# EAGLE design TheRug-Andabil-R2 (EAGLE 7.7.0)

## Sheet 1 of 2
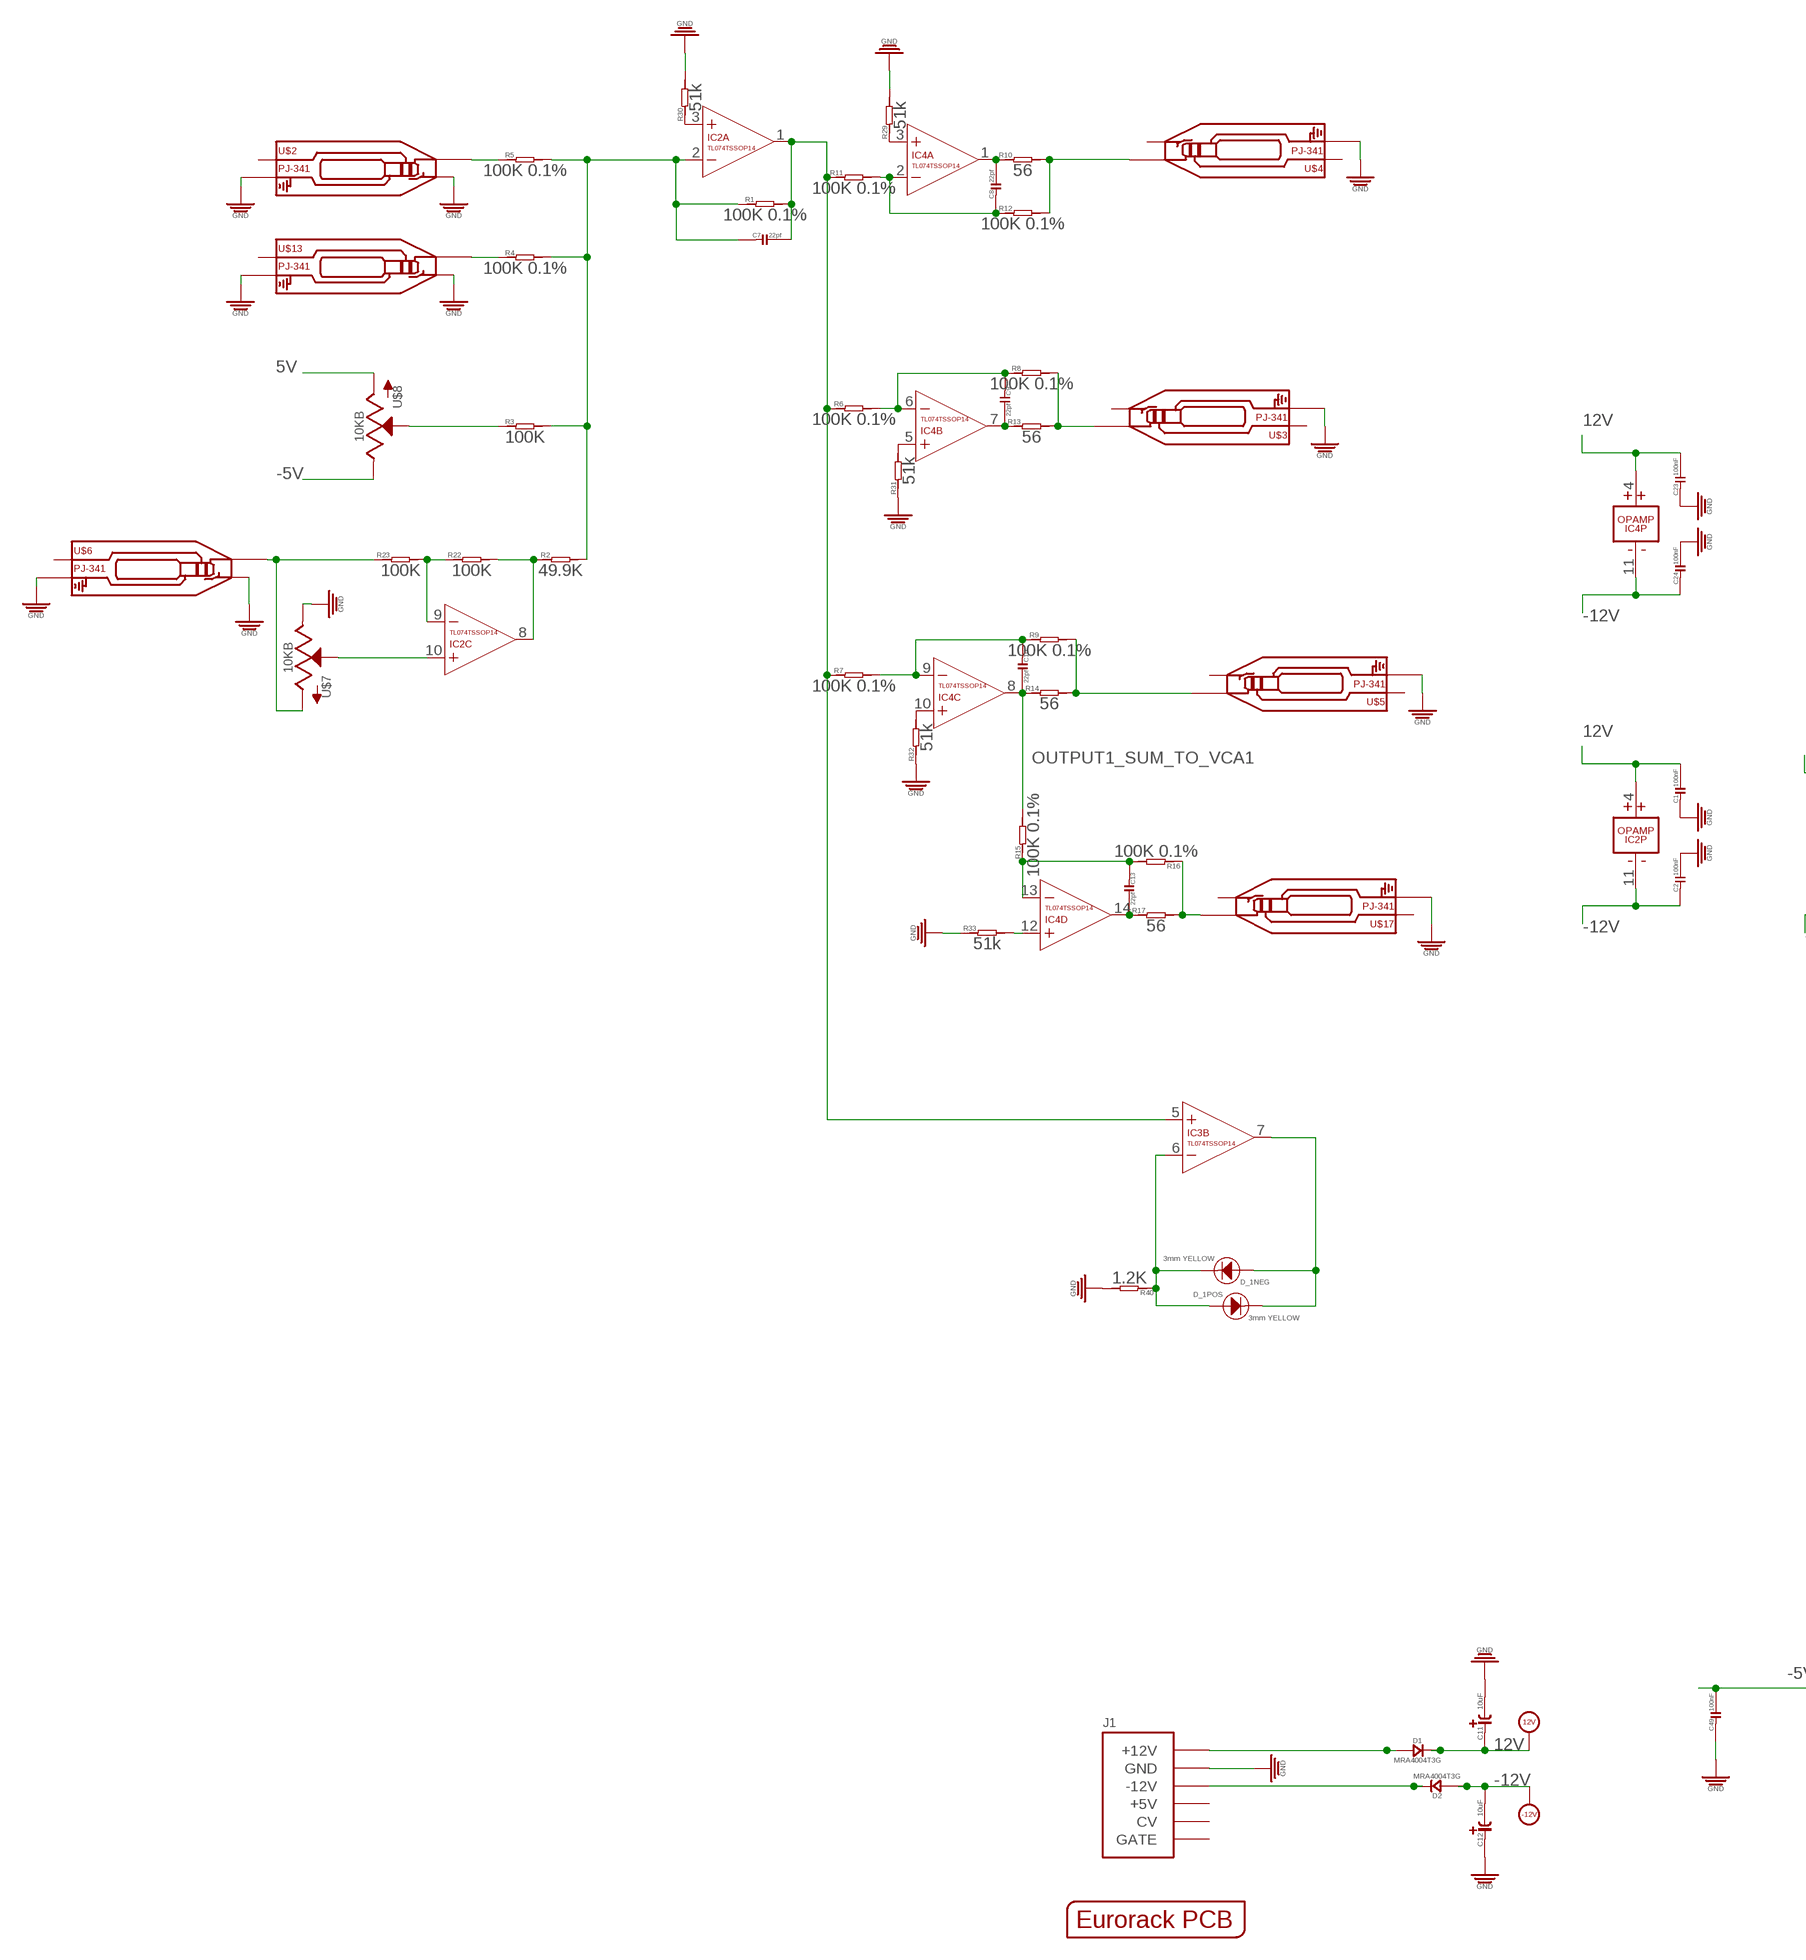
[diagram p0: schematic, sheet 1, part 1 of 2]
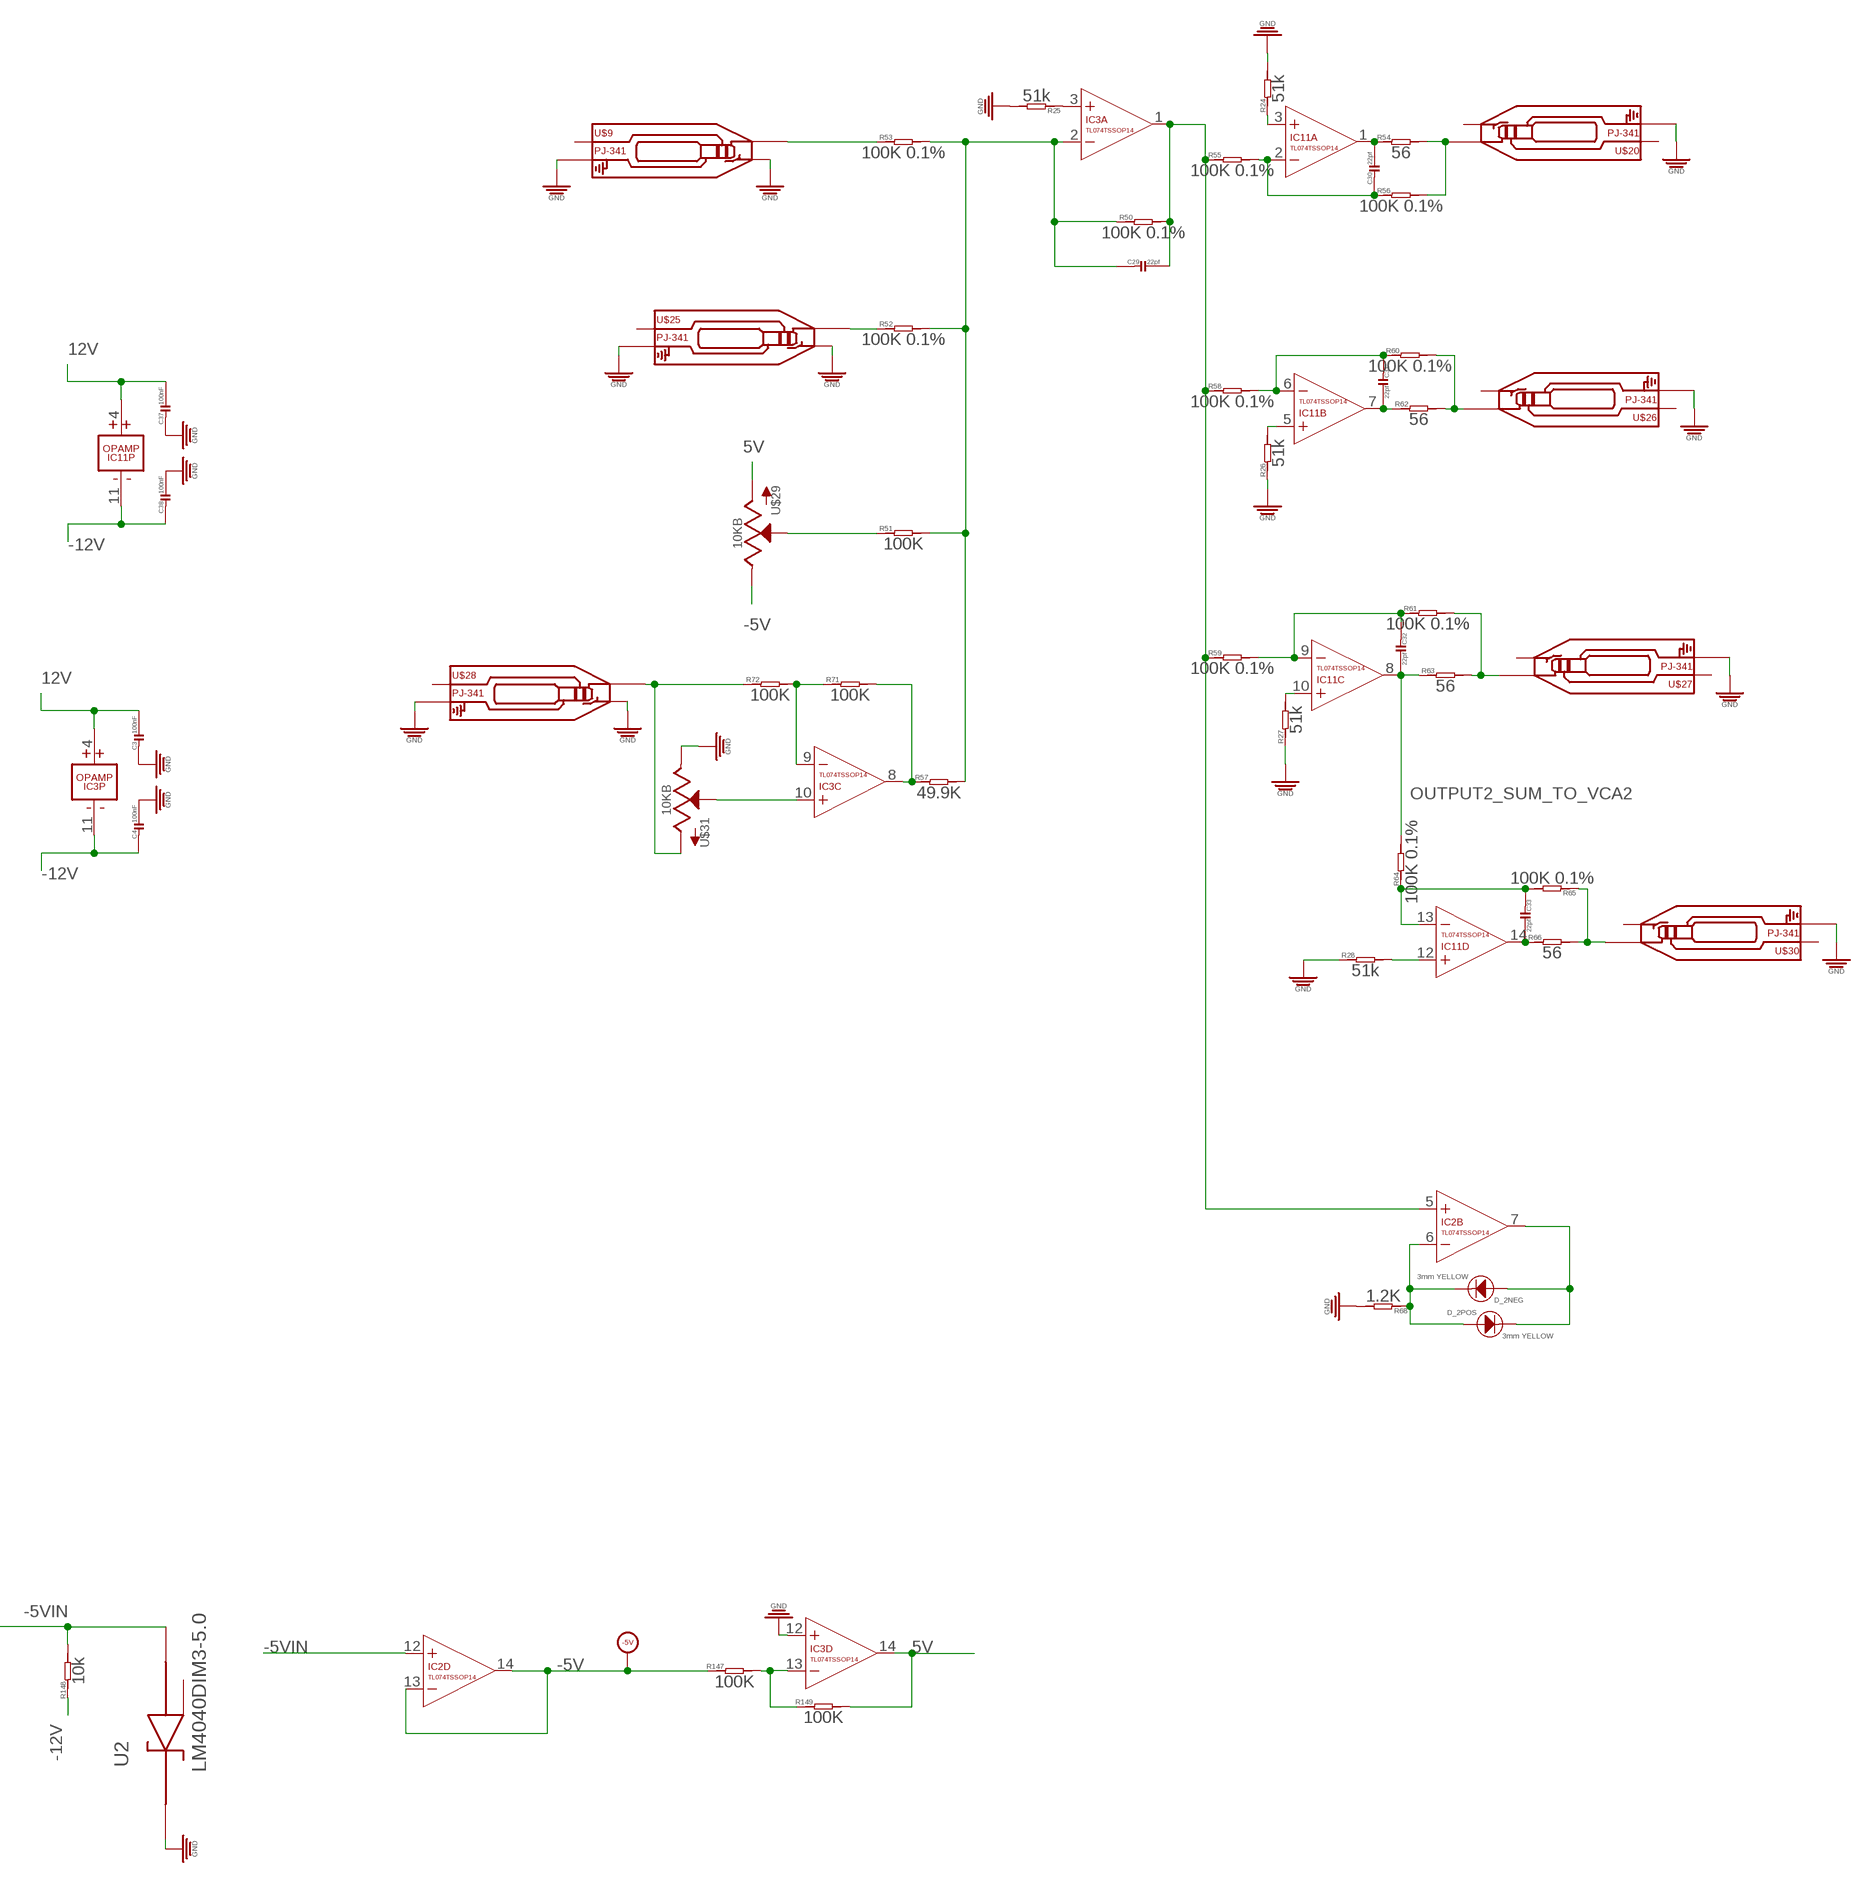
[diagram p1: schematic, sheet 1, part 2 of 2]

### Parts
C1  100nF  C-0603  [C0603]
C2  100nF  C-0603  [C0603]
C3  100nF  C-0603  [C0603]
C4  100nF  C-0603  [C0603]
C7  22pf  C-0603  [C0603]
C8  22pf  C-0603  [C0603]
C9  22pf  C-0603  [C0603]
C10  22pf  C-0603  [C0603]
C11  10uF  C-POLAR-A  [CASE-A_3216]
C12  10uF  C-POLAR-A  [CASE-A_3216]
C13  22pf  C-0603  [C0603]
C23  100nF  C-0603  [C0603]
C24  100nF  C-0603  [C0603]
C29  22pf  C-0603  [C0603]
C30  22pf  C-0603  [C0603]
C31  22pf  C-0603  [C0603]
C32  22pf  C-0603  [C0603]
C33  22pf  C-0603  [C0603]
C37  100nF  C-0603  [C0603]
C38  100nF  C-0603  [C0603]
C49  100nF  C-0603  [C0603]
D1  MRA4004T3G  D-SMA  [DO-214AC]
D2  MRA4004T3G  D-SMA  [DO-214AC]
D_1NEG  3mm YELLOW  LED3MM  [3MMLED]
D_1POS  3mm YELLOW  LED3MM  [3MMLED]
D_2NEG  3mm YELLOW  LED3MM  [3MMLED]
D_2POS  3mm YELLOW  LED3MM  [3MMLED]
IC2  TL074TSSOP14  [TSSOP14]
IC3  TL074TSSOP14  [TSSOP14]
IC4  TL074TSSOP14  [TSSOP14]
IC11  TL074TSSOP14  [TSSOP14]
J1  POWERSHROUDED  [POWER_16_SHROUDED]
R1  100K 0.1%  R-0603  [R0603]
R2  49.9K  R-0603  [R0603]
R3  100K  R-0603  [R0603]
R4  100K 0.1%  R-0603  [R0603]
R5  100K 0.1%  R-0603  [R0603]
R6  100K 0.1%  R-0603  [R0603]
R7  100K 0.1%  R-0603  [R0603]
R8  100K 0.1%  R-0603  [R0603]
R9  100K 0.1%  R-0603  [R0603]
R10  56  R-0603  [R0603]
R11  100K 0.1%  R-0603  [R0603]
R12  100K 0.1%  R-0603  [R0603]
R13  56  R-0603  [R0603]
R14  56  R-0603  [R0603]
R15  100K 0.1%  R-0603  [R0603]
R16  100K 0.1%  R-0603  [R0603]
R17  56  R-0603  [R0603]
R22  100K  R-0603  [R0603]
R23  100K  R-0603  [R0603]
R24  51k  R-0603  [R0603]
R25  51k  R-0603  [R0603]
R26  51k  R-0603  [R0603]
R27  51k  R-0603  [R0603]
R28  51k  R-0603  [R0603]
R29  51k  R-0603  [R0603]
R30  51k  R-0603  [R0603]
R31  51k  R-0603  [R0603]
R32  51k  R-0603  [R0603]
R33  51k  R-0603  [R0603]
R40  1.2K  R-0603  [R0603]
R50  100K 0.1%  R-0603  [R0603]
R51  100K  R-0603  [R0603]
R52  100K 0.1%  R-0603  [R0603]
R53  100K 0.1%  R-0603  [R0603]
R54  56  R-0603  [R0603]
R55  100K 0.1%  R-0603  [R0603]
R56  100K 0.1%  R-0603  [R0603]
R57  49.9K  R-0603  [R0603]
R58  100K 0.1%  R-0603  [R0603]
R59  100K 0.1%  R-0603  [R0603]
R60  100K 0.1%  R-0603  [R0603]
R61  100K 0.1%  R-0603  [R0603]
R62  56  R-0603  [R0603]
R63  56  R-0603  [R0603]
R64  100K 0.1%  R-0603  [R0603]
R65  100K 0.1%  R-0603  [R0603]
R66  56  R-0603  [R0603]
R68  1.2K  R-0603  [R0603]
R71  100K  R-0603  [R0603]
R72  100K  R-0603  [R0603]
R147  100K  R-0603  [R0603]
R148  10k  R-0603  [R0603]
R149  100K  R-0603  [R0603]
U2  LM4040DIM3-5.0  [SOT95P237X112-3N]
U$1  EURORACK_PCB12HP  [EURORACK12HPPCB]
U$2  PJ-341  AUDIO-JACK_SMALLSYMBOLNODRILL  [3.5MM-JACK-SWITCH-13MM-NOHOLES]
U$3  PJ-341  AUDIO-JACK_SMALLSYMBOLNODRILL  [3.5MM-JACK-SWITCH-13MM-NOHOLES]
U$4  PJ-341  AUDIO-JACK_SMALLSYMBOLNODRILL  [3.5MM-JACK-SWITCH-13MM-NOHOLES]
U$5  PJ-341  AUDIO-JACK_SMALLSYMBOLNODRILL  [3.5MM-JACK-SWITCH-13MM-NOHOLES]
U$6  PJ-341  AUDIO-JACK_SMALLSYMBOLNODRILL  [3.5MM-JACK-SWITCH-13MM-NOHOLES]
U$7  10KB  POTSQUAREHOLE_SMALLKNOB  [ALPS_POT_SQUAREHOLES]
U$8  10KB  POTSQUAREHOLE_SMALLKNOB  [ALPS_POT_SQUAREHOLES]
U$9  PJ-341  AUDIO-JACK_SMALLSYMBOLNODRILL  [3.5MM-JACK-SWITCH-13MM-NOHOLES]
U$13  PJ-341  AUDIO-JACK_SMALLSYMBOLNODRILL  [3.5MM-JACK-SWITCH-13MM-NOHOLES]
U$17  PJ-341  AUDIO-JACK_SMALLSYMBOLNODRILL  [3.5MM-JACK-SWITCH-13MM-NOHOLES]
U$20  PJ-341  AUDIO-JACK_SMALLSYMBOLNODRILL  [3.5MM-JACK-SWITCH-13MM-NOHOLES]
U$25  PJ-341  AUDIO-JACK_SMALLSYMBOLNODRILL  [3.5MM-JACK-SWITCH-13MM-NOHOLES]
U$26  PJ-341  AUDIO-JACK_SMALLSYMBOLNODRILL  [3.5MM-JACK-SWITCH-13MM-NOHOLES]
U$27  PJ-341  AUDIO-JACK_SMALLSYMBOLNODRILL  [3.5MM-JACK-SWITCH-13MM-NOHOLES]
U$28  PJ-341  AUDIO-JACK_SMALLSYMBOLNODRILL  [3.5MM-JACK-SWITCH-13MM-NOHOLES]
U$29  10KB  POTSQUAREHOLE_SMALLKNOB  [ALPS_POT_SQUAREHOLES]
U$30  PJ-341  AUDIO-JACK_SMALLSYMBOLNODRILL  [3.5MM-JACK-SWITCH-13MM-NOHOLES]
U$31  10KB  POTSQUAREHOLE_SMALLKNOB  [ALPS_POT_SQUAREHOLES]

### Nets
5V [heavypower]: IC3.14(D:OUT) R149.2 U$8.P$3(A) U$29.P$3(A)
12V [heavypower]: C1.2 C3.2 C11.+ C23.2 C37.2 D1.2(-) IC2.4(P:V+) IC3.4(P:V+) IC4.4(P:V+) IC11.4(P:V+) ; also sheet 2
-5V [heavypower]: IC2.13(D:-IN) IC2.14(D:OUT) R147.1 U$8.P$1(E) U$29.P$1(E) ; also sheet 2
-5V_TO_5V: IC3.13(D:-IN) R147.2 R149.1
-5VIN [heavypower]: C49.2 IC2.12(D:+IN) R148.2 U2.2(ANODE)
-12V [heavypower]: C2.1 C4.1 C12.- C24.1 C38.1 D2.1(+) IC2.11(P:V-) IC3.11(P:V-) IC4.11(P:V-) IC11.11(P:V-) R148.1 ; also sheet 2
GND: C1.1 C2.2 C3.1 C4.2 C11.- C12.+ C23.1 C24.2 C37.1 C38.2 C49.1 IC3.12(D:+IN) J1.3(GND) J1.4(GND) J1.5(GND) J1.6(GND) J1.7(GND) J1.8(GND) R24.2 R25.2 R26.1 R27.1 R28.1 R29.2 R30.2 R31.1 R32.1 R33.1 R40.2 R68.2 U2.1(CATHODE) U$2.RING_B@1(RING) U$2.RING_T@3(RING) U$2.SWITCH_B@1(SWITCH) U$2.SWITCH_T@3(SWITCH) U$3.RING_B@1(RING) U$3.RING_T@3(RING) U$4.RING_B@1(RING) U$4.RING_T@3(RING) U$5.RING_B@1(RING) U$5.RING_T@3(RING) U$6.RING_B@1(RING) U$6.RING_T@3(RING) U$6.SWITCH_B@1(SWITCH) U$6.SWITCH_T@3(SWITCH) U$7.P$1(E) U$9.RING_B@1(RING) U$9.RING_T@3(RING) U$9.SWITCH_B@1(SWITCH) U$9.SWITCH_T@3(SWITCH) U$13.RING_B@1(RING) U$13.RING_T@3(RING) U$13.SWITCH_B@1(SWITCH) U$13.SWITCH_T@3(SWITCH) U$17.RING_B@1(RING) U$17.RING_T@3(RING) U$20.RING_B@1(RING) U$20.RING_T@3(RING) U$25.RING_B@1(RING) U$25.RING_T@3(RING) U$25.SWITCH_B@1(SWITCH) U$25.SWITCH_T@3(SWITCH) U$26.RING_B@1(RING) U$26.RING_T@3(RING) U$27.RING_B@1(RING) U$27.RING_T@3(RING) U$28.RING_B@1(RING) U$28.RING_T@3(RING) U$28.SWITCH_B@1(SWITCH) U$28.SWITCH_T@3(SWITCH) U$30.RING_B@1(RING) U$30.RING_T@3(RING) U$31.P$1(E) ; also sheet 2
N$1: IC2.10(C:+IN) U$7.P$2(S)
N$2: C8.2 IC4.1(A:OUT) R10.1
N$3: IC2.8(C:OUT) R2.1 R22.2
N$4: R23.1 U$6.TIP_B@1(TIP) U$6.TIP_T@3(TIP) U$7.P$3(A)
N$5: C9.1 IC4.6(B:-IN) R6.2 R8.1
N$6: R3.1 U$8.P$2(S)
N$7: C7.2 IC2.1(A:OUT) IC3.5(B:+IN) R1.2 R6.1 R7.1 R11.1
N$8: C8.1 IC4.2(A:-IN) R11.2 R12.1
N$9: C10.1 IC4.9(C:-IN) R7.2 R9.1
N$10: IC2.9(C:-IN) R22.1 R23.2
N$11: C9.2 IC4.7(B:OUT) R13.1
N$12: R4.1 U$13.TIP_B@1(TIP) U$13.TIP_T@3(TIP)
N$13: R60.2 R62.2 U$26.TIP_B@1(TIP) U$26.TIP_T@3(TIP)
N$14: C7.1 IC2.2(A:-IN) R1.1 R2.2 R3.2 R4.2 R5.2
N$15: R8.2 R13.2 U$3.TIP_B@1(TIP) U$3.TIP_T@3(TIP)
N$16: R9.2 R14.2 U$5.TIP_B@1(TIP) U$5.TIP_T@3(TIP)
N$17: C13.1 IC4.13(D:-IN) R15.1 R16.2
N$18: C13.2 IC4.14(D:OUT) R17.1
N$19: R16.1 R17.2 U$17.TIP_B@1(TIP) U$17.TIP_T@3(TIP)
N$20: R5.1 U$2.TIP_B@1(TIP) U$2.TIP_T@3(TIP)
N$22: R10.2 R12.2 U$4.TIP_B@1(TIP) U$4.TIP_T@3(TIP)
N$26: IC11.3(A:+IN) R24.1
N$27: IC3.3(A:+IN) R25.1
N$28 [heavypower]: D1.1(+) J1.9(+12V) J1.10(+12V)
N$29: IC11.5(B:+IN) R26.2
N$30: IC11.10(C:+IN) R27.2
N$31: R65.1 R66.2 U$30.TIP_B@1(TIP) U$30.TIP_T@3(TIP)
N$32: IC11.12(D:+IN) R28.2
N$33: IC4.3(A:+IN) R29.1
N$34: IC2.3(A:+IN) R30.1
N$35: IC4.5(B:+IN) R31.2
N$36: IC4.10(C:+IN) R32.2
N$37: IC4.12(D:+IN) R33.2
N$44: D_1NEG.- D_1POS.+ IC3.6(B:-IN) R40.1
N$45: D_1NEG.+ D_1POS.- IC3.7(B:OUT)
N$53: C30.2 IC11.1(A:OUT) R54.1
N$54: R51.1 U$29.P$2(S)
N$63: R52.1 U$25.TIP_B@1(TIP) U$25.TIP_T@3(TIP)
N$64 [heavypower]: D2.2(-) J1.1(-12V) J1.2(-12V)
N$65: C29.1 IC3.2(A:-IN) R50.1 R51.2 R52.2 R53.2 R57.2
N$66: R54.2 R56.2 U$20.TIP_B@1(TIP) U$20.TIP_T@3(TIP)
N$67: C29.2 IC2.5(B:+IN) IC3.1(A:OUT) R50.2 R55.1 R58.1 R59.1
N$68: C30.1 IC11.2(A:-IN) R55.2 R56.1
N$69: R53.1 U$9.TIP_B@1(TIP) U$9.TIP_T@3(TIP)
N$70: R72.1 U$28.TIP_B@1(TIP) U$28.TIP_T@3(TIP) U$31.P$3(A)
N$71: C31.1 IC11.6(B:-IN) R58.2 R60.1
N$72: C32.1 IC11.9(C:-IN) R59.2 R61.1
N$73: C31.2 IC11.7(B:OUT) R62.1
N$76: R61.2 R63.2 U$27.TIP_B@1(TIP) U$27.TIP_T@3(TIP)
N$77: C33.1 IC11.13(D:-IN) R64.1 R65.2
N$78: C33.2 IC11.14(D:OUT) R66.1
N$80: D_2NEG.- D_2POS.+ IC2.6(B:-IN) R68.1
N$81: D_2NEG.+ D_2POS.- IC2.7(B:OUT)
N$84: IC3.10(C:+IN) U$31.P$2(S)
N$85: IC3.8(C:OUT) R57.1 R71.2
N$86: IC3.9(C:-IN) R71.1 R72.2
OUTPUT1_SUM_TO_VCA1: C10.2 IC4.8(C:OUT) R14.1 R15.2 ; also sheet 2
OUTPUT2_SUM_TO_VCA2: C32.2 IC11.8(C:OUT) R63.1 R64.2 ; also sheet 2
Unconnected: J1.11(+5V) J1.12(+5V) J1.13(CV) J1.14(CV) J1.15(GATE) J1.16(GATE) U2.3(NC) U$2.SECOND_B@1(SECOND) U$2.SECOND_T@3(SECOND) U$3.SECOND_B@1(SECOND) U$3.SECOND_T@3(SECOND) U$3.SWITCH_B@1(SWITCH) U$3.SWITCH_T@3(SWITCH) U$4.SECOND_B@1(SECOND) U$4.SECOND_T@3(SECOND) U$4.SWITCH_B@1(SWITCH) U$4.SWITCH_T@3(SWITCH) U$5.SECOND_B@1(SECOND) U$5.SECOND_T@3(SECOND) U$5.SWITCH_B@1(SWITCH) U$5.SWITCH_T@3(SWITCH) U$6.SECOND_B@1(SECOND) U$6.SECOND_T@3(SECOND) U$9.SECOND_B@1(SECOND) U$9.SECOND_T@3(SECOND) U$13.SECOND_B@1(SECOND) U$13.SECOND_T@3(SECOND) U$17.SECOND_B@1(SECOND) U$17.SECOND_T@3(SECOND) U$17.SWITCH_B@1(SWITCH) U$17.SWITCH_T@3(SWITCH) U$20.SECOND_B@1(SECOND) U$20.SECOND_T@3(SECOND) U$20.SWITCH_B@1(SWITCH) U$20.SWITCH_T@3(SWITCH) U$25.SECOND_B@1(SECOND) U$25.SECOND_T@3(SECOND) U$26.SECOND_B@1(SECOND) U$26.SECOND_T@3(SECOND) U$26.SWITCH_B@1(SWITCH) U$26.SWITCH_T@3(SWITCH) U$27.SECOND_B@1(SECOND) U$27.SECOND_T@3(SECOND) U$27.SWITCH_B@1(SWITCH) U$27.SWITCH_T@3(SWITCH) U$28.SECOND_B@1(SECOND) U$28.SECOND_T@3(SECOND) U$30.SECOND_B@1(SECOND) U$30.SECOND_T@3(SECOND) U$30.SWITCH_B@1(SWITCH) U$30.SWITCH_T@3(SWITCH)

## Sheet 2 of 2
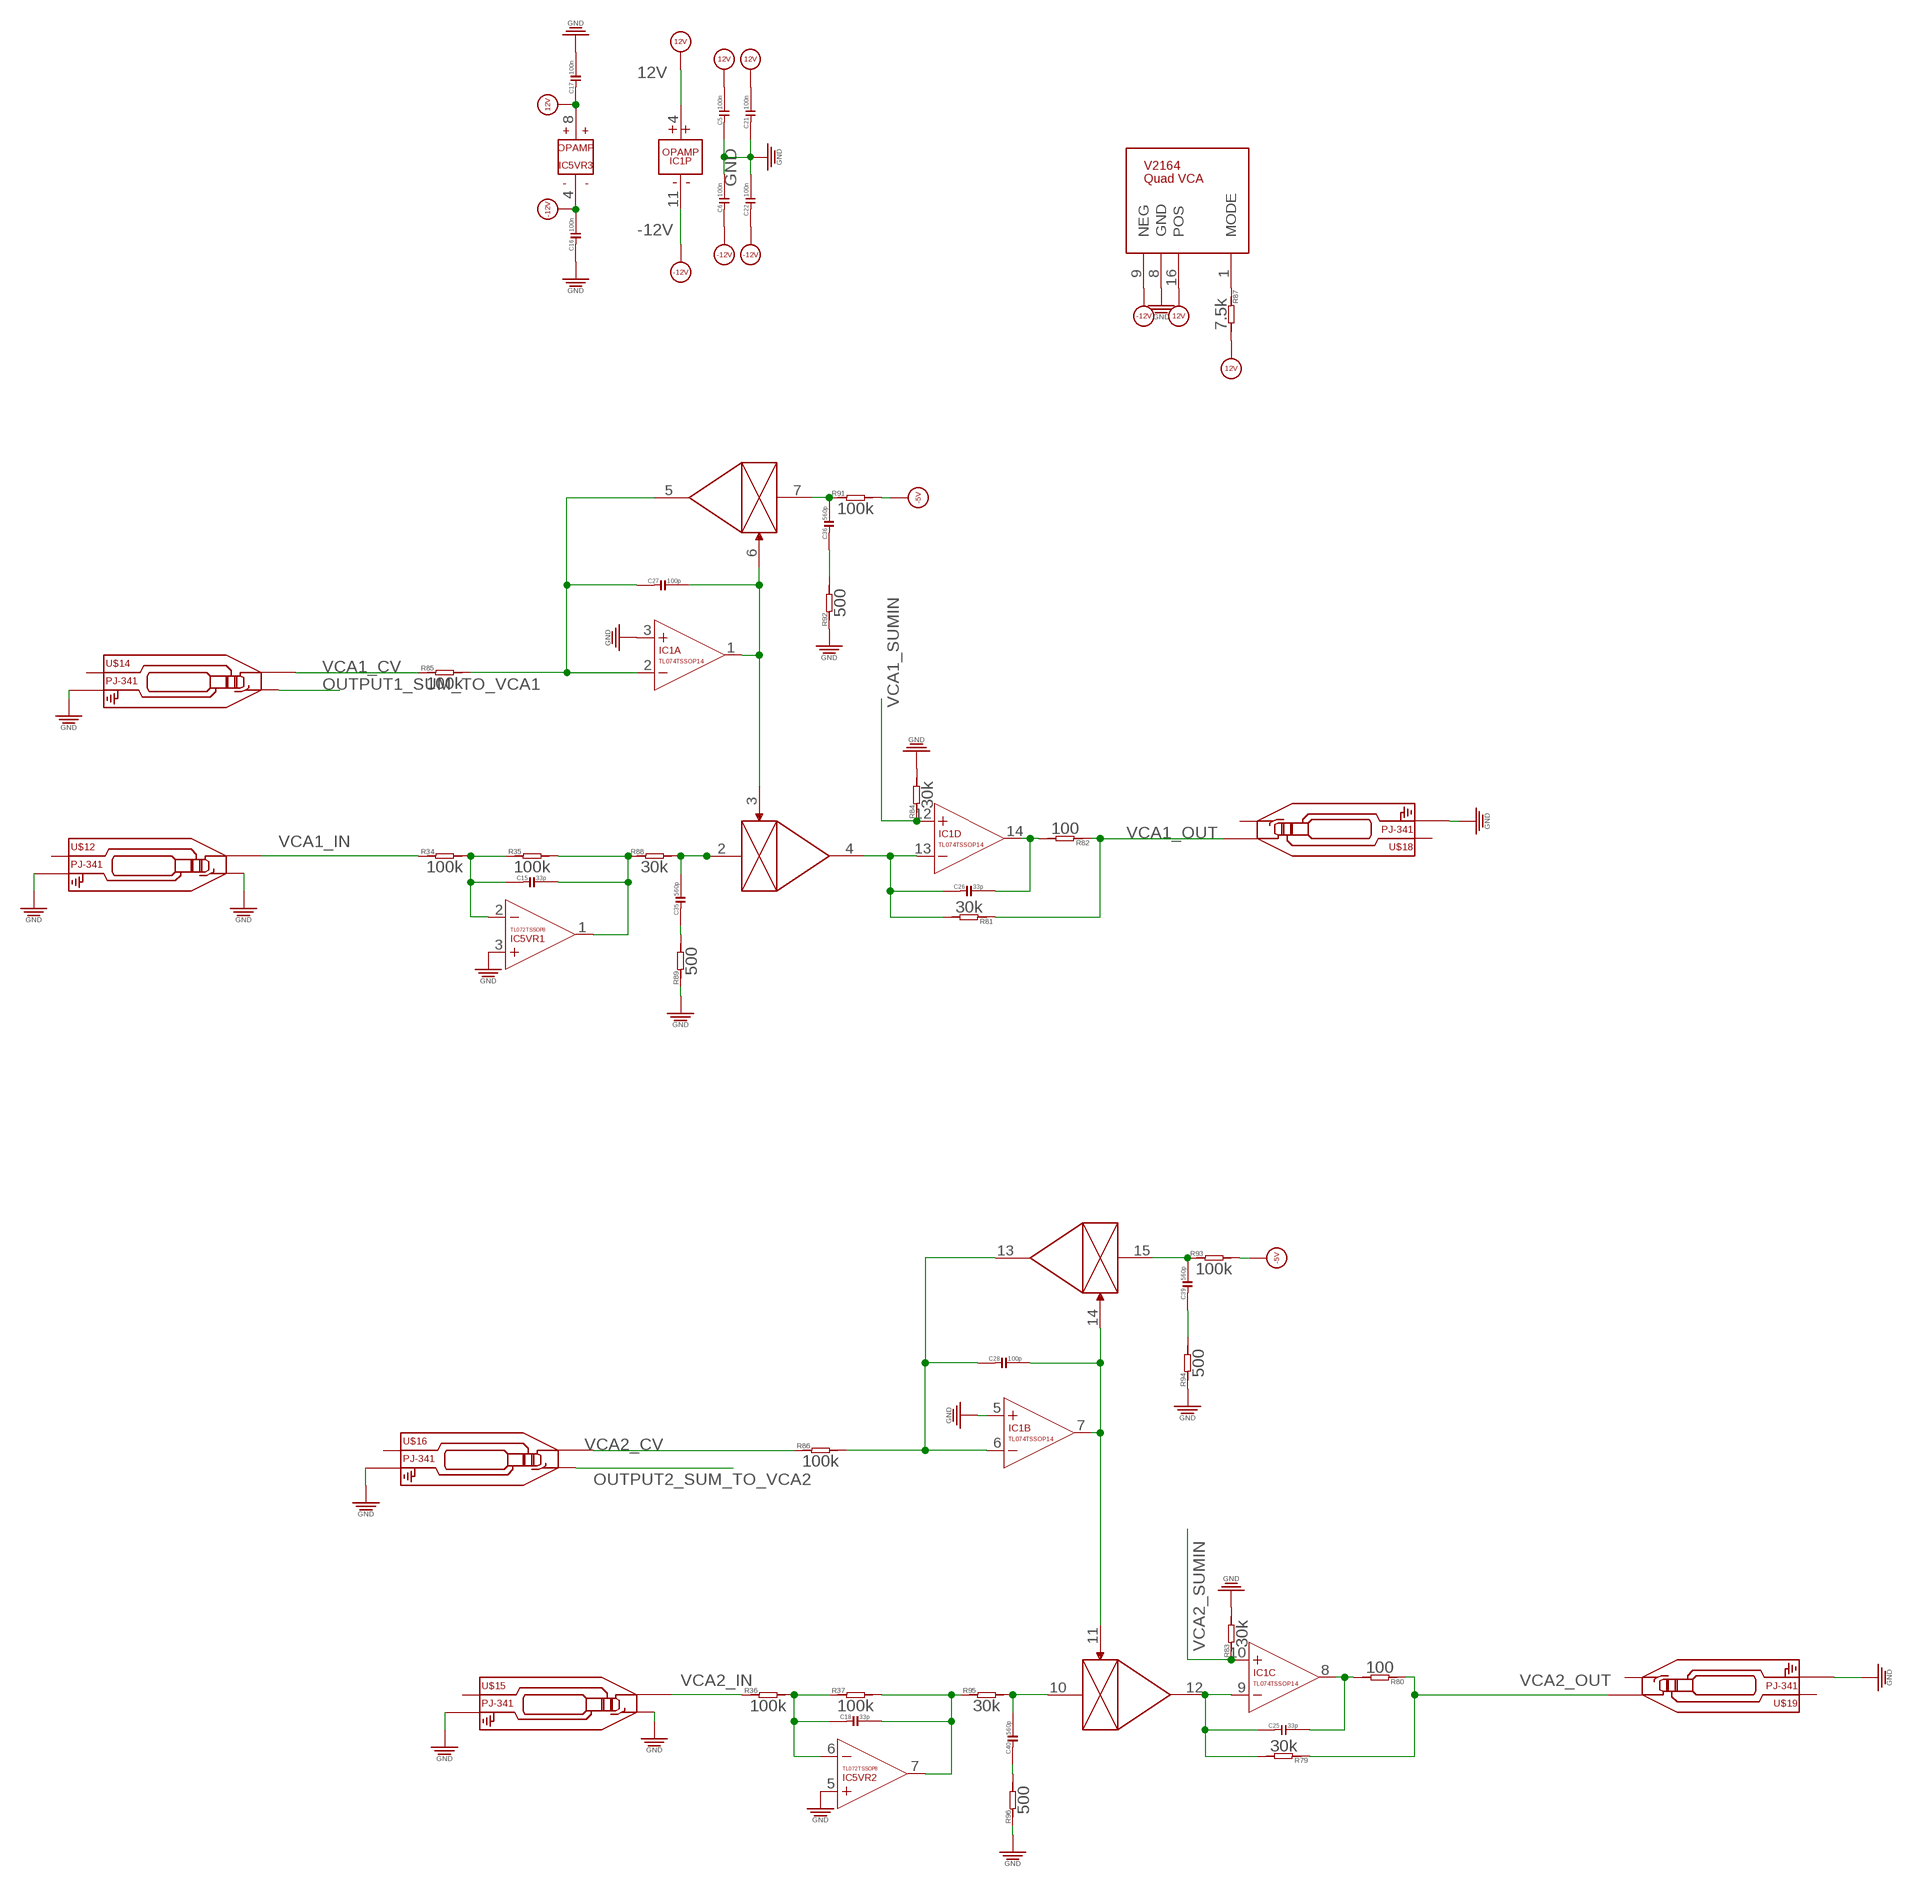
[diagram p2: schematic, sheet 2]

### Parts
C5  100n  C-0603  [C0603]
C6  100n  C-0603  [C0603]
C15  33p  C-0603  [C0603]
C16  100n  C-0603  [C0603]
C17  100n  C-0603  [C0603]
C18  33p  C-0603  [C0603]
C21  100n  C-0603  [C0603]
C22  100n  C-0603  [C0603]
C25  33p  C-0603  [C0603]
C26  33p  C-0603  [C0603]
C27  100p  C-0603  [C0603]
C28  100p  C-0603  [C0603]
C35  560p  C-0603  [C0603]
C36  560p  C-0603  [C0603]
C39  560p  C-0603  [C0603]
C40  560p  C-0603  [C0603]
IC1  TL074TSSOP14  [TSSOP14]
IC5  TL072TSSOP8  [TSSOP8]
R34  100k  R-0603  [R0603]
R35  100k  R-0603  [R0603]
R36  100k  R-0603  [R0603]
R37  100k  R-0603  [R0603]
R79  30k  R-0603  [R0603]
R80  100  R-0603  [R0603]
R81  30k  R-0603  [R0603]
R82  100  R-0603  [R0603]
R83  30k  R-0603  [R0603]
R84  30k  R-0603  [R0603]
R85  100k  R-0603  [R0603]
R86  100k  R-0603  [R0603]
R87  7.5k  R-0603  [R0603]
R88  30k  R-0603  [R0603]
R89  500  R-0603  [R0603]
R91  100k  R-0603  [R0603]
R92  500  R-0603  [R0603]
R93  100k  R-0603  [R0603]
R94  500  R-0603  [R0603]
R95  30k  R-0603  [R0603]
R96  500  R-0603  [R0603]
U$12  PJ-341  AUDIO-JACK_SMALLSYMBOLNODRILL  [3.5MM-JACK-SWITCH-13MM-NOHOLES]
U$14  PJ-341  AUDIO-JACK_SMALLSYMBOLNODRILL  [3.5MM-JACK-SWITCH-13MM-NOHOLES]
U$15  PJ-341  AUDIO-JACK_SMALLSYMBOLNODRILL  [3.5MM-JACK-SWITCH-13MM-NOHOLES]
U$16  PJ-341  AUDIO-JACK_SMALLSYMBOLNODRILL  [3.5MM-JACK-SWITCH-13MM-NOHOLES]
U$18  PJ-341  AUDIO-JACK_SMALLSYMBOLNODRILL  [3.5MM-JACK-SWITCH-13MM-NOHOLES]
U$19  PJ-341  AUDIO-JACK_SMALLSYMBOLNODRILL  [3.5MM-JACK-SWITCH-13MM-NOHOLES]
U$32  V2164  [SO16]

### Nets
12V [heavypower]: C5.2 C17.1 C21.2 IC1.4(P:V+) IC5.8(VR3:V+) R87.2 U$32.16(PWR:POS) ; also sheet 1
-5V [heavypower]: R91.2 R93.2 ; also sheet 1
-12V [heavypower]: C6.1 C16.2 C22.1 IC1.11(P:V-) IC5.4(VR3:V-) U$32.9(PWR:NEG) ; also sheet 1
GND: C5.1 C6.2 C16.1 C17.2 C21.1 C22.2 IC1.3(A:+IN) IC1.5(B:+IN) IC5.3(VR1:+IN) IC5.5(VR2:+IN) R83.2 R84.2 R89.1 R92.1 R94.1 R96.1 U$12.RING_B@1(RING) U$12.RING_T@3(RING) U$12.SWITCH_B@1(SWITCH) U$12.SWITCH_T@3(SWITCH) U$14.RING_B@1(RING) U$14.RING_T@3(RING) U$15.RING_B@1(RING) U$15.RING_T@3(RING) U$15.SWITCH_B@1(SWITCH) U$15.SWITCH_T@3(SWITCH) U$16.RING_B@1(RING) U$16.RING_T@3(RING) U$18.RING_B@1(RING) U$18.RING_T@3(RING) U$19.RING_B@1(RING) U$19.RING_T@3(RING) U$32.8(PWR:GND) ; also sheet 1
N$38: C15.1 IC5.2(VR1:-IN) R34.2 R35.1
N$39: C15.2 IC5.1(VR1:OUT) R35.2 R88.1
N$40: C18.1 IC5.6(VR2:-IN) R36.2 R37.1
N$41: C18.2 IC5.7(VR2:OUT) R37.2 R95.1
N$61: C25.2 IC1.8(C:OUT) R80.2
N$74: C25.1 IC1.9(C:-IN) R79.2 U$32.12(C:OUT)
N$87: C26.2 IC1.14(D:OUT) R82.2
N$88: C26.1 IC1.13(D:-IN) R81.2 U$32.4(A:OUT)
N$89: C27.2 IC1.1(A:OUT) U$32.3(A:CV) U$32.6(B:CV)
N$90: C28.1 IC1.6(B:-IN) R86.2 U$32.13(D:OUT)
N$91: C28.2 IC1.7(B:OUT) U$32.11(C:CV) U$32.14(D:CV)
N$92: R87.1 U$32.1(PWR:MODE)
N$93: C35.1 R89.2
N$94: C35.2 R88.2 U$32.2(A:IN)
N$95: C36.2 R91.1 U$32.7(B:IN)
N$96: C36.1 R92.2
N$97: C39.2 R93.1 U$32.15(D:IN)
N$98: C39.1 R94.2
N$99: C40.1 R96.2
N$100: C40.2 R95.2 U$32.10(C:IN)
OUTPUT1_SUM_TO_VCA1: U$14.SWITCH_B@1(SWITCH) U$14.SWITCH_T@3(SWITCH) ; also sheet 1
OUTPUT2_SUM_TO_VCA2: U$16.SWITCH_B@1(SWITCH) U$16.SWITCH_T@3(SWITCH) ; also sheet 1
VCA1_CV: R85.1 U$14.TIP_B@1(TIP) U$14.TIP_T@3(TIP)
VCA1_FB: C27.1 IC1.2(A:-IN) R85.2 U$32.5(B:OUT)
VCA1_IN: R34.1 U$12.TIP_B@1(TIP) U$12.TIP_T@3(TIP)
VCA1_OUT: R81.1 R82.1 U$18.TIP_B@1(TIP) U$18.TIP_T@3(TIP)
VCA1_SUMIN: IC1.12(D:+IN) R84.1
VCA2_CV: R86.1 U$16.TIP_B@1(TIP) U$16.TIP_T@3(TIP)
VCA2_IN: R36.1 U$15.TIP_B@1(TIP) U$15.TIP_T@3(TIP)
VCA2_OUT: R79.1 R80.1 U$19.TIP_B@1(TIP) U$19.TIP_T@3(TIP)
VCA2_SUMIN: IC1.10(C:+IN) R83.1
Unconnected: U$12.SECOND_B@1(SECOND) U$12.SECOND_T@3(SECOND) U$14.SECOND_B@1(SECOND) U$14.SECOND_T@3(SECOND) U$15.SECOND_B@1(SECOND) U$15.SECOND_T@3(SECOND) U$16.SECOND_B@1(SECOND) U$16.SECOND_T@3(SECOND) U$18.SECOND_B@1(SECOND) U$18.SECOND_T@3(SECOND) U$18.SWITCH_B@1(SWITCH) U$18.SWITCH_T@3(SWITCH) U$19.SECOND_B@1(SECOND) U$19.SECOND_T@3(SECOND) U$19.SWITCH_B@1(SWITCH) U$19.SWITCH_T@3(SWITCH)

## Library data of the parts
C1-C10 C13 C15-C18 C21-C33 C35-C40 = OPL:C*
C11 C12 = EurorackModularParts:C-POLAR*
C49 = OPL:C*; MF: AVX; MPN: 06035C104KAT2A; OC_FARNELL: 1301804
D1 D2 = OPL:D*: DIODE; MF: VISHAY; MPN: US1G-E3/5AT; OC_FARNELL: 9551824
D_1NEG D_1POS D_2NEG D_2POS = EurorackModularParts:LED*: LED
IC1-IC4 IC11 = EurorackModularParts:TL074: OP AMP
IC5 = EurorackModularParts:TL072
J1 = EurorackModularParts:POWER
R1-R17 R22-R37 R40 R50-R66 R68 R71 R72 R79-R89 R91-R96 R147 R149 = OPL:R*
R148 = OPL:R*; OC_FARNELL: unknown
U2 = FarnellThings:LM4040DIM3-5.0: IC, Precision Micropower Shunt Voltage Reference, 5V,SOT-23-3; MF: TEXAS INSTRUMENTS; MPN: LM4040DIM3-5.0; OC_FARNELL: 9778330; OC_NEWARK: 97K3489; PACKAGE: SOT-23-3; SUPPLIER: TEXAS INSTRUMENTS
U$1 = EurorackModularParts:EURORACK_PCB
U$2 = EurorackModularParts:AUDIO-JACK_SMALLSYMBOL: Switching Mono 3.5mm Audio Jack from Erthenvar.; DESC: 1: A
U$3 = EurorackModularParts:AUDIO-JACK_SMALLSYMBOL: Switching Mono 3.5mm Audio Jack from Erthenvar.; DESC: 1: Out 2
U$4 = EurorackModularParts:AUDIO-JACK_SMALLSYMBOL: Switching Mono 3.5mm Audio Jack from Erthenvar.; DESC: 1: Out 1
U$5 = EurorackModularParts:AUDIO-JACK_SMALLSYMBOL: Switching Mono 3.5mm Audio Jack from Erthenvar.; DESC: 1: Out 3
U$6 = EurorackModularParts:AUDIO-JACK_SMALLSYMBOL: Switching Mono 3.5mm Audio Jack from Erthenvar.; DESC: 1: C
U$7 = EurorackModularParts:POT; DESC: 1: C Amp
U$8 = EurorackModularParts:POT; DESC: 1: Offset
U$9 = EurorackModularParts:AUDIO-JACK_SMALLSYMBOL: Switching Mono 3.5mm Audio Jack from Erthenvar.; DESC: 2: A
U$12 = EurorackModularParts:AUDIO-JACK_SMALLSYMBOL: Switching Mono 3.5mm Audio Jack from Erthenvar.; DESC: VCA1 In
U$13 = EurorackModularParts:AUDIO-JACK_SMALLSYMBOL: Switching Mono 3.5mm Audio Jack from Erthenvar.; DESC: 1: B
U$14 = EurorackModularParts:AUDIO-JACK_SMALLSYMBOL: Switching Mono 3.5mm Audio Jack from Erthenvar.; DESC: VCA1 CV
U$15 = EurorackModularParts:AUDIO-JACK_SMALLSYMBOL: Switching Mono 3.5mm Audio Jack from Erthenvar.; DESC: VCA2 In
U$16 = EurorackModularParts:AUDIO-JACK_SMALLSYMBOL: Switching Mono 3.5mm Audio Jack from Erthenvar.; DESC: VCA2 CV
U$17 = EurorackModularParts:AUDIO-JACK_SMALLSYMBOL: Switching Mono 3.5mm Audio Jack from Erthenvar.; DESC: 1: Inverted
U$18 = EurorackModularParts:AUDIO-JACK_SMALLSYMBOL: Switching Mono 3.5mm Audio Jack from Erthenvar.; DESC: VCA1 Out
U$19 = EurorackModularParts:AUDIO-JACK_SMALLSYMBOL: Switching Mono 3.5mm Audio Jack from Erthenvar.; DESC: VCA2 Out
U$20 = EurorackModularParts:AUDIO-JACK_SMALLSYMBOL: Switching Mono 3.5mm Audio Jack from Erthenvar.; DESC: 2: Out 1
U$25 = EurorackModularParts:AUDIO-JACK_SMALLSYMBOL: Switching Mono 3.5mm Audio Jack from Erthenvar.; DESC: 2: B
U$26 = EurorackModularParts:AUDIO-JACK_SMALLSYMBOL: Switching Mono 3.5mm Audio Jack from Erthenvar.; DESC: 2: Out 2
U$27 = EurorackModularParts:AUDIO-JACK_SMALLSYMBOL: Switching Mono 3.5mm Audio Jack from Erthenvar.; DESC: 2: Out 3
U$28 = EurorackModularParts:AUDIO-JACK_SMALLSYMBOL: Switching Mono 3.5mm Audio Jack from Erthenvar.; DESC: 2: C
U$29 = EurorackModularParts:POT; DESC: 2: Offset
U$30 = EurorackModularParts:AUDIO-JACK_SMALLSYMBOL: Switching Mono 3.5mm Audio Jack from Erthenvar.; DESC: 2: Inverted
U$31 = EurorackModularParts:POT; DESC: 2: C Amp
U$32 = EurorackModularParts:V2164

## Net classes
0 default: width 0.203 mm
1 heavypower: width 0.381 mm

## Board
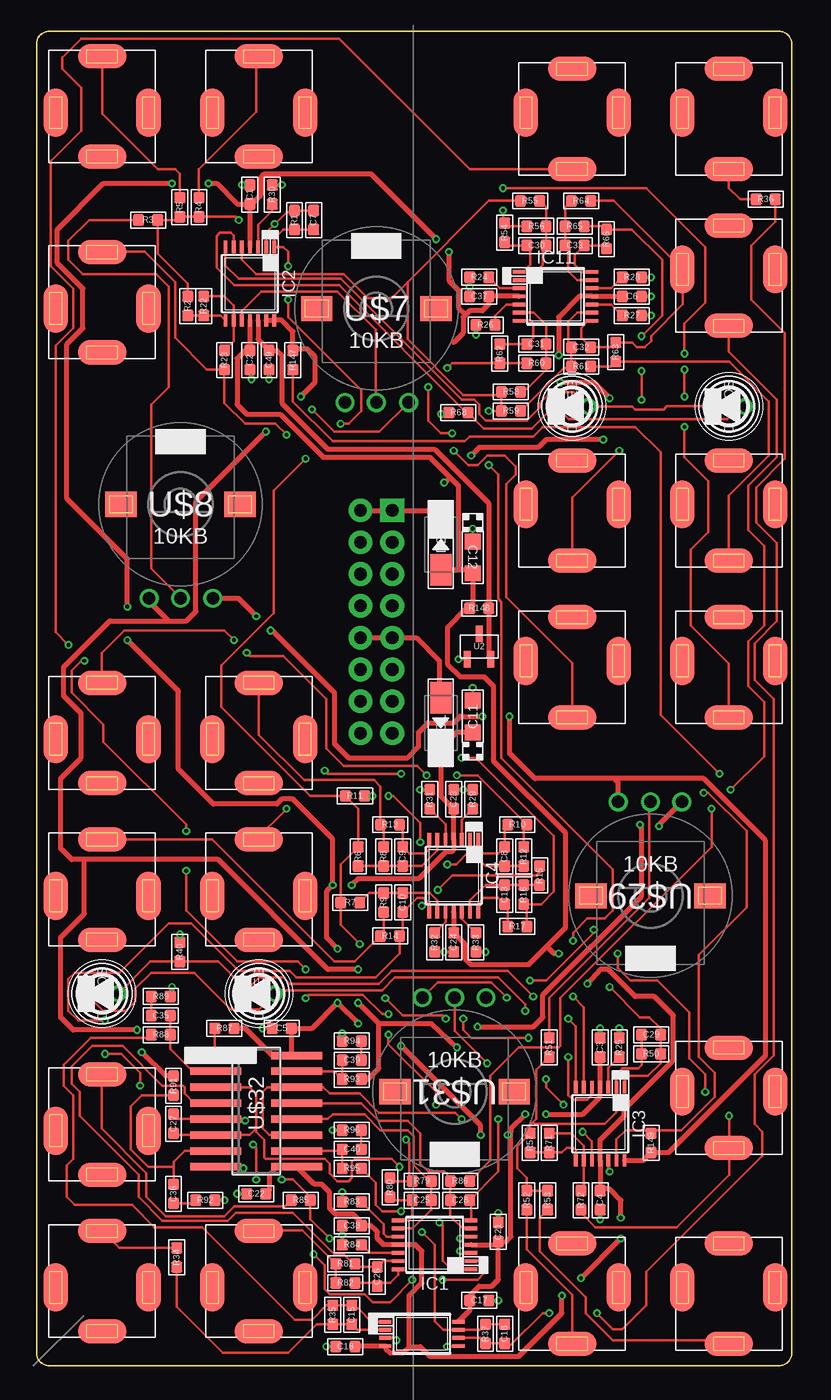
[diagram p3: board, top side]
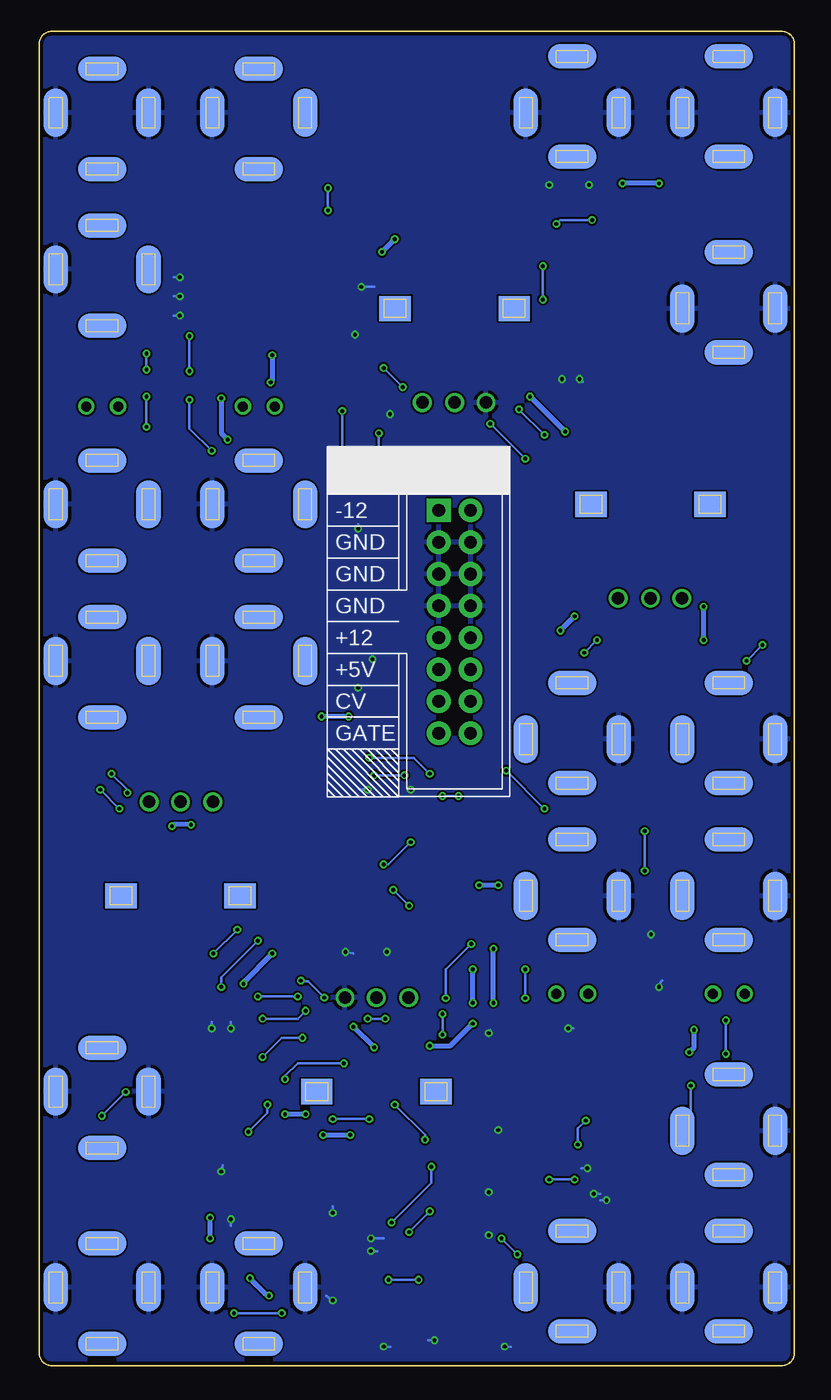
[diagram p4: board, bottom side, seen from below]

Size 60.25 x 106.5 mm. Coordinates in mm from the lower left corner, seen from the top.
Copper layers (1*16): Top 0.035mm / dielectric 1.5mm / Bottom 0.035mm
Design rules "ITEADstudio_DRC": minimum track width 6mil, minimum drill 12mil, track to track 6mil, track to pad 6mil, pad to pad 6mil, via to via 6mil, smd to smd 0mil, copper to edge 10mil, drill to drill 10mil, minimum pad ring 10mil, minimum via ring 6mil, stop-mask expansion 2mil, vias tented up to drill 100mil, thermal gap 10mil

### Footprints (pad centres in the part's own frame; a part is rotated, then mirrored left to right if it is on the bottom)
C0603 = smd 0.889 x 0.889: 1 -0.762,0; 2 0.762,0
CASE-A_3216 = smd 1.27 x 1.27: + -1.27,0; - 1.27,0
DO-214AC = smd 2.5 x 1.7: 1 -2,0; 2 2,0
3MMLED = drill 0.8: + -1.27,0; - 1.27,0
TSSOP14 = smd 0.305 x 0.991: 1 -1.95,-2.918; 2 -1.3,-2.918; 3 -0.65,-2.918; 4 0,-2.918; 5 0.65,-2.918; 6 1.3,-2.918; 7 1.95,-2.918; 8 1.95,2.918; 9 1.3,2.918; 10 0.65,2.918; 11 0,2.918; 12 -0.65,2.918; 13 -1.3,2.918; 14 -1.95,2.918
TSSOP8 = smd 0.305 x 0.991: 1 -0.975,-2.918; 2 -0.325,-2.918; 3 0.325,-2.918; 4 0.975,-2.918; 5 0.975,2.918; 6 0.325,2.918; 7 -0.325,2.918; 8 -0.975,2.918
POWER_16_SHROUDED = drill 1.016 pad 1.88 square: 1 -8.89,-1.27 | drill 1.016 pad 1.88: 2 -8.89,1.27; 3 -6.35,-1.27; 4 -6.35,1.27; 5 -3.81,-1.27; 6 -3.81,1.27; 7 -1.27,-1.27; 8 -1.27,1.27; 9 1.27,-1.27; 10 1.27,1.27; 11 3.81,-1.27; 12 3.81,1.27; 13 6.35,-1.27; 14 6.35,1.27; 15 8.89,-1.27; 16 8.89,1.27
R0603 = smd 0.889 x 0.889: 1 -0.762,0; 2 0.762,0
SOT95P237X112-3N = smd 1.321 x 0.559: 1 -1.016,0.94; 2 -1.016,-0.94; 3 1.016,0
3.5MM-JACK-SWITCH-13MM-NOHOLES = smd 1.95 x 3.85 bottom: RING_B@1 -3.7,0; SWITCH_B@1 3.7,0 | smd 1.95 x 3.85: RING_T@3 -3.7,0; SWITCH_T@3 3.7,0 | smd 3.85 x 1.95 bottom: SECOND_B@1 0,-3.5; TIP_B@1 0,4.5 | smd 3.85 x 1.95: SECOND_T@3 0,-3.5; TIP_T@3 0,4.5
ALPS_POT_SQUAREHOLES = drill 1: P$1 -2.5,-7.5; P$2 0,-7.5; P$3 2.58,-7.5 | smd 2.5 x 2: P$4 -4.75,0; P$5 4.75,0 | smd 2.5 x 2 bottom: P$6 -4.75,0; P$7 4.75,0
SO16 = smd 0.6 x 4.064: 1 -4.445,-3.235; 2 -3.175,-3.235; 3 -1.905,-3.235; 4 -0.635,-3.235; 5 0.635,-3.235; 6 1.905,-3.235; 7 3.175,-3.235; 8 4.445,-3.235; 9 4.445,3.235; 10 3.175,3.235; 11 1.905,3.235; 12 0.635,3.235; 13 -0.635,3.235; 14 -1.905,3.235; 15 -3.175,3.235; 16 -4.445,3.235

### Placement (x,y rotation side)
C1  17.02,93.47 270 top
C2  17.02,80.26 270 top
C3  44.96,25.4 270 top
C4  44.96,13.21 270 top
C5  19.56,26.92 0 top
C6  47.5,85.34 0 top
C7  22.1,91.44 270 top
C8  37.34,40.64 90 top
C9  29.21,40.64 90 top
C10  29.21,36.96 270 top
C11  34.8,51.82 90 top
C12  34.8,64.52 270 top
C13  37.34,37.59 270 top
C15  25.15,4.06 90 top
C16  24.64,1.52 0 top
C17  35.31,5.21 0 top
C18  37.34,2.54 90 top
C21  36.83,10.67 270 top
C22  17.53,13.72 180 top
C23  33.28,45.21 270 top
C24  33.28,33.78 270 top
C25  30.74,13.21 180 top
C26  27.18,7.11 270 top
C27  10.93,19.3 270 top
C28  33.79,13.21 0 top
C29  49.03,26.42 0 top
C30  39.88,89.41 180 top
C31  39.88,81.53 180 top
C32  43.44,81.28 0 top
C33  42.93,89.41 0 top
C35  9.91,27.94 0 top
C36  10.93,13.72 90 top
C37  35.31,85.34 0 top
C38  25.15,11.18 180 top
C39  25.15,24.38 180 top
C40  25.15,17.27 180 top
C49  18.55,80.26 90 top
D1  32.26,51.31 270 top
D2  32.26,65.53 90 top
D_1NEG  17.73,29.69 180 top
D_1POS  5.23,29.69 180 top
D_2NEG  42.73,76.56 180 top
D_2POS  55.23,76.56 180 top
IC1  31.75,9.65 90 top
IC2  17.02,86.36 180 top
IC3  44.96,19.3 180 top
IC4  33.28,39.12 180 top
IC5  30.74,2.54 270 top
IC11  41.41,85.34 270 top
J1  27.11,59.38 270 bottom
R1  20.58,91.44 270 top
R2  12.07,84.58 90 top
R3  8.89,91.44 0 top
R4  12.96,92.46 270 top
R5  11.43,92.46 270 top
R6  25.66,40.64 270 top
R7  25.02,36.96 0 top
R8  27.69,40.64 90 top
R9  27.69,36.96 270 top
R10  38.36,43.18 0 top
R11  25.4,45.47 0 top
R12  38.87,40.64 90 top
R13  28.2,43.18 180 top
R14  28.2,34.29 180 top
R15  40.14,39.12 90 top
R16  38.87,37.59 90 top
R17  38.36,35.05 0 top
R22  13.34,84.58 270 top
R23  14.99,80.26 90 top
R24  35.31,86.87 180 top
R25  46.49,25.4 90 top
R26  35.82,83.06 0 top
R27  47.5,83.82 180 top
R28  47.5,86.87 180 top
R29  34.8,45.21 90 top
R30  18.8,93.47 90 top
R31  31.37,45.21 270 top
R32  31.75,33.78 90 top
R33  35.06,33.78 90 top
R34  11.18,8.64 270 top
R35  23.63,4.06 90 top
R36  58.17,93.09 0 top
R37  35.82,2.54 90 top
R40  11.43,33.02 90 top
R50  49.03,24.89 0 top
R51  40.9,25.4 270 top
R52  39.12,13.21 90 top
R53  40.77,13.21 90 top
R54  37.34,90.42 90 top
R55  39.37,92.96 0 top
R56  39.88,90.93 180 top
R57  39.37,17.78 90 top
R58  37.85,77.72 0 top
R59  37.85,76.2 0 top
R60  39.88,80.01 180 top
R61  43.44,79.76 0 top
R62  36.96,80.77 270 top
R63  46.21,80.89 270 top
R64  43.44,92.96 0 top
R65  42.93,90.93 180 top
R66  45.47,89.92 90 top
R68  33.66,76.07 180 top
R71  40.9,17.78 270 top
R72  43.44,13.21 90 top
R79  30.74,14.73 0 top
R80  28.2,14.22 270 top
R81  24.64,8.13 0 top
R82  24.64,6.6 0 top
R83  25.15,13.08 180 top
R84  25.15,9.65 180 top
R85  21.09,13.21 0 top
R86  33.79,14.73 180 top
R87  14.99,26.92 0 top
R88  9.91,26.42 0 top
R89  9.91,29.46 180 top
R91  10.93,22.35 90 top
R92  13.47,13.21 180 top
R93  25.15,22.86 0 top
R94  25.15,25.91 0 top
R95  25.15,15.75 180 top
R96  25.15,18.8 0 top
R147  20.45,80.26 270 top
R148  35.31,60.45 0 top
R149  49.03,17.78 270 top
U2  35.31,57.4 90 top
U$1  -0.25,0 0 top
U$2  5.23,100 0 top
U$3  17.73,50 0 top
U$4  5.23,50 0 top
U$5  5.23,37.5 0 top
U$6  5.23,84.38 0 top
U$7  27.11,84.38 0 top
U$8  11.48,68.75 0 top
U$9  55.23,6.25 180 top
U$12  5.23,6.25 0 top
U$13  17.73,100 0 top
U$14  5.23,18.75 0 top
U$15  55.23,100 180 top
U$16  55.23,87.5 180 top
U$17  17.73,37.5 0 top
U$18  17.73,6.25 0 top
U$19  42.73,100 180 top
U$20  55.23,56.25 180 top
U$25  42.73,6.25 180 top
U$26  42.73,56.25 180 top
U$27  55.23,68.75 180 top
U$28  55.23,21.88 180 top
U$29  48.98,37.5 180 top
U$30  42.73,68.75 180 top
U$31  33.36,21.88 180 top
U$32  17.53,20.32 270 top

### Tracks (layer width: path | path; a pad name or v marks a point on that pad's centre or on a via)
5V  (via drill 0.3)
  Top 0.381: IC3.14 48.39,16.39 R149.2 50.42,17.02 58.17,24.77 58.17,41.91 53.22,46.86 46.11,46.86 | U$29.P$3 46.4,46.57 46.11,46.86 | U$8.P$3 16.1,61.25 v17.53,59.82 | v18.67,58.67 18.8,58.67 23.75,53.72 23.75,49.66 24.9,48.51 29.59,48.51 30.48,49.4 30.48,50.55 31.25,51.31 33.28,51.31 33.79,51.82 v35.56,51.82 | 46.11,46.86 39.76,46.86 37.72,48.9 v37.72,51.82
  Bottom 0.381: v17.53,59.82 v18.67,58.67 | v35.56,51.82 v37.72,51.82
12V  (via drill 0.3)
  Top 0.381: IC11.4 C37.2 36.07,84.71 35.56,84.2 34.55,84.2 34.23,83.88 | IC1.4 36.58,9.65 C21.2 | IC5.8 34.55,4.41 C17.1 34.55,5.59 35.31,6.35 36.33,6.35 36.83,6.86 C21.2 | C3.2 IC3.4 44.96,21.46 43.56,20.07 v40.64,20.07 | U$32.16 20.2,24.77 | 20.2,24.77 18.8,24.77 16.64,26.92 R87.2 | 20.2,24.77 20.32,24.89 C5.2 21.98,26.92 v24.01,28.96 v25.66,27.3 | C11.+ 33.5,50.55 D1.2 32.26,45.47 C23.2 IC4.4 33.28,41.15 33.15,41.02 32.64,41.02 30.48,38.86 25.66,38.86 v25.15,38.35 | C1.2 IC2.4 | 34.23,83.88 34.04,83.69 34.04,82.42 33.28,81.66 | C1.2 17.15,92.71 17.91,93.47 17.91,94.87 18.16,95.12 26.67,95.12 v31.88,89.92 | v32.9,88.9 32.9,86.61 33.66,85.85 33.66,84.45 34.23,83.88 | C21.2 37.47,9.91 37.85,10.29 37.85,18.67 | v38.99,20.07 37.85,18.92 37.85,18.67 | v24.01,33.27 23.12,34.16 23.12,37.85 v23.63,38.35 23.63,42.04 20.45,45.21 19.56,45.21 19.18,44.83 14.1,44.83 11.31,47.62 11.31,53.85 v7.24,57.91 | v7.24,60.58 7.24,64.39 2.42,69.22 2.42,81.53 3.69,82.8 3.69,85.98 1.66,88.01 1.66,90.68 5.34,94.36 v10.8,94.36 | v13.72,94.36 14.36,94.36 16.01,92.71 C1.2 | 37.85,18.67 v37.6,18.41 | v35.44,18.41 35.44,19.18 v29.09,25.53
  Bottom 0.381: v31.88,89.92 v32.9,88.9 | v38.99,20.07 v40.64,20.07 | v24.01,28.96 v24.01,33.27 | v25.15,38.35 v23.63,38.35 | v7.24,57.91 v7.24,60.58 | v10.8,94.36 v13.72,94.36 | v37.6,18.41 v35.44,18.41 | v29.09,25.53 27.44,25.53 v25.66,27.3
-5V  (via drill 0.3)
  Top 0.381: IC2.13 IC2.14 19.56,83.44 20.45,82.55 R147.1 20.58,81.15 21.59,81.15 22.23,80.52 22.23,78.49 v21.09,77.34 | U$8.P$1 8.98,61 10.55,59.44 | 10.55,59.44 11.94,59.44 12.7,60.2 12.7,68.96 v18.29,74.55 | R93.2 26.42,22.86 27.31,23.75 27.31,27.3 | 27.31,27.3 v25.66,28.96 | v25.66,31.62 23.25,31.62 14.48,40.39 3.81,40.39 | 3.81,40.39 2.8,40.39 1.91,41.27 1.91,46.86 3.56,48.51 3.56,52.07 2.16,53.47 2.16,55.75 5.85,59.44 10.55,59.44 | R91.2 10.29,23.11 v8.39,25.02 | v8,26.8 2.93,26.8 1.91,27.81 1.91,34.16 3.81,36.07 3.81,40.39 | v48.14,43.18 48.26,43.05 48.26,37.47 40.39,29.59 40.39,27.81 39.63,27.05 v35.18,27.05 | v49.66,43.05 49.66,43.18 U$29.P$1 | 27.31,27.3 31.5,27.3 v33.53,25.4
  Bottom 0.381: v18.29,74.55 v21.09,77.34 | v25.66,28.96 v25.66,31.62 | v8.39,25.02 8,25.4 v8,26.8 | v48.14,43.18 49.53,43.18 v49.66,43.05 | v33.53,25.4 v35.18,27.05
-5V_TO_5V  (via drill 0.3)
  Top 0.203: IC3.13 46.26,18.06 46.99,18.8 48.77,18.8 | 48.77,18.8 R149.1 | R147.2 20.45,76.96 23.63,73.79 34.17,73.79 34.55,74.17 39.63,74.17 40.39,74.93 47.76,74.93 49.79,72.9 49.79,51.94 v54.49,47.24 | 48.77,18.8 51.44,18.8 54.11,21.46 54.11,23.37 52.84,24.64 52.84,32.77 56.65,36.58 56.65,42.67 53.6,45.72 v53.22,45.72
  Bottom 0.203: v53.22,45.72 53.22,45.97 v54.49,47.24
-5VIN
  Top 0.381: IC2.12 17.67,81.9 C49.2 19.18,81.03 19.56,80.64 19.56,76.83 23.25,73.15 31.75,73.15 36.07,68.83 R148.2 36.07,56.57 U2.2
-12V  (via drill 0.3)
  Top 0.381: C6.1 IC11.11 43.31,85.34 41.66,83.69 v41.66,80.64 | C22.1 18.55,13.97 18.55,15.24 19.18,15.88 U$32.9 22.16,14.48 22.74,14.48 23.37,13.84 23.37,12.57 23.88,12.06 25.28,12.06 25.91,11.43 C38.1 26.67,11.18 27.18,10.67 27.18,10.16 27.69,9.65 IC1.11 30.23,9.65 30.74,9.14 30.74,6.6 29.72,5.59 29.72,1.52 | C16.2 25.45,1.56 IC5.4 27.82,1.39 28.2,1.02 29.21,1.02 29.72,1.52 | D2.1 33.53,63.53 | 33.53,63.53 34.52,63.53 | 34.52,63.53 C12.- | IC2.11 C2.1 16.64,81.03 16.01,80.39 16.01,76.71 16.77,75.95 19.44,75.95 22.86,72.52 31.37,72.52 33.02,70.87 | IC4.11 C24.1 34.17,33.66 34.17,32.51 34.67,32 39.25,32 40.71,33.47 | 34.52,63.53 34.64,63.53 34.93,63.25 C12.- | C12.- 34.8,60.71 R148.1 34.29,60.45 32.77,58.93 32.77,56.01 33.79,54.99 35.69,54.99 36.45,54.23 36.45,48.26 42.17,42.55 42.17,34.92 40.71,33.47 | 33.02,70.87 33.66,70.23 33.66,63.66 33.53,63.53 | 29.72,1.52 30.61,1.52 31.37,0.76 38.48,0.76 41.91,4.19 v41.91,5.59 | v43.44,6.99 v46.61,10.16 | v46.61,11.81 46.61,13.21 45.72,14.1 45.09,14.1 C4.1 IC3.11 44.96,18.03 46.87,19.94 46.87,20.45 50.8,24.38 50.8,27.94 49.28,29.46 47.76,29.46 45.6,31.62 44.96,31.62 v43.95,30.48 | v41.66,32.89 41.28,32.89 40.71,33.47 | v41.79,78.49 44.45,78.49 v45.72,77.22 | v45.22,73.91 40.64,73.91 40.01,73.28 35.31,73.28 v34.67,72.64 | v32.52,70.48 32.64,70.48 33.02,70.87
  Bottom 0.381: v41.91,5.59 42.04,5.59 v43.44,6.99 | v46.61,10.16 v46.61,11.81 | v43.95,30.48 43.95,30.61 v41.66,32.89 | v41.66,80.64 41.66,78.61 v41.79,78.49 | v45.72,77.22 45.72,74.42 v45.22,73.91 | v34.67,72.64 v32.52,70.48
GND  (via drill 0.3)
  Top 0.203: C6.2 v49.03,85.34 | R28.1 v49.03,86.87 | R27.1 v49.03,83.82 | R92.1 v14.99,13.21 | C22.2 v16.01,13.72 | U$32.8 16.39,15.88 v16.51,15.75 | IC1.5 33.93,10.3 v33.79,10.16 | IC1.3 33.93,9 v33.79,9.14 | C21.1 v36.83,12.19 | C17.2 v36.83,5.21 | IC5.5 32.81,1.56 v32.77,1.52 | IC5.3 28.52,2.21 v28.71,2.03 | C16.1 v23.12,1.52 | C4.2 v44.96,11.68 | IC3.12 45.61,15.73 v45.72,15.49 | C3.1 v44.96,26.92 | R25.2 v46.49,26.92 | C5.1 v18.04,26.92 | R94.1 v24.39,26.54 | R96.1 v23.63,18.8 | C12.+ v34.8,66.8 | U2.1 v33.66,56.39 | C11.- v34.8,54.1 | R31.1 v30.61,45.97 | C37.1 v34.55,86.11 R24.2 | R26.1 v35.06,82.3 | R33.1 v35.82,33.02 | C24.2 v32.52,33.02 R32.1 | C38.2 v24.39,10.41 R84.2 | R83.2 v24.39,13.84 | R40.2 v11.43,34.42 | R89.1 10.67,30.1 v10.8,30.23 | C2.2 17.02,78.87 v17.15,78.74 | C49.1 v18.55,78.74 | C1.1 v16.39,94.23 | R30.2 v19.56,94.23 | R68.2 32.39,76.07 v32.26,75.95 | R29.2 v34.04,45.97 C23.1
  Bottom 0.203: v49.03,85.34 49.53,85.34 | v49.03,86.87 49.53,86.87 | v49.03,83.82 49.53,83.82 | v14.99,13.21 15.5,13.21 | v16.01,13.72 15.5,13.72 | v16.51,15.75 17.02,15.75 | v33.79,10.16 32.77,10.16 | v33.79,9.14 33.28,9.14 | v36.83,12.19 36.83,12.7 | v36.83,5.21 37.34,5.59 | v32.77,1.52 32.26,1.52 | v28.71,2.03 29.21,2.03 | v23.12,1.52 22.61,1.52 | v44.96,11.68 44.96,11.18 | v45.72,15.49 45.6,16 | v44.96,26.92 44.96,27.43 | v46.49,26.92 46.49,27.43 | v18.04,26.92 17.66,26.92 | v24.39,26.54 24.39,26.67 24.26,26.8 | v23.63,18.8 23.63,19.05 | v34.8,66.8 34.8,67.18 | v33.66,56.39 33.66,56.64 | v34.8,54.1 34.55,54.1 | v30.61,45.97 30.74,46.1 | v34.04,45.97 34.67,45.97 | v34.55,86.11 33.53,86.11 | v35.06,82.3 34.93,82.3 | v35.82,33.02 35.18,32.89 | 32.64,32.89 v32.52,33.02 32.39,32.89 | v24.39,10.41 24.52,10.41 | v24.39,13.84 24.39,13.59 | v11.43,34.42 11.43,34.67 | v10.8,30.23 10.8,30.48 10.55,30.73 | v17.15,78.74 16.89,78.49 | v18.55,78.74 18.55,78.61 | v16.39,94.23 16.13,94.23 | v19.56,94.23 19.82,94.23 | v32.26,75.95 32.13,76.07
  pour Bottom: 65.29,112.15 -11.08,108.71 -10.44,-4.32 69.38,-8.57
N$1
  Top 0.203: IC2.10 16.37,84.19 17.91,85.72 24.01,85.72 27.05,82.68 27.05,76.92 U$7.P$2
N$2
  Top 0.203: IC4.1 35.23,41.36 35.69,40.89 36.83,40.89 C8.2 37.34,42.93 R10.1
N$3
  Top 0.203: R2.1 R22.2 14.69,83.82 IC2.8
N$4  (via drill 0.3)
  Top 0.203: U$6.TIP_T@3 5.25,88.9 8.64,88.9 11.05,86.49 11.05,82.04 13.59,79.5 R23.1 14.99,76.83 16.64,75.18 19.05,75.18 v19.94,74.3 | v21.98,76.33 23.75,74.55 27.36,74.55 U$7.P$3
  Bottom 0.203: v21.98,76.33 v19.94,74.3
N$5
  Top 0.203: IC4.6 31.98,41.12 30.74,39.88 C9.1 R8.1 R6.2
N$6
  Top 0.203: R3.1 4.2,91.44 2.54,89.79 2.54,88.27 3.69,87.12 9.53,87.12 10.55,86.11 10.55,78.11 9.15,76.71 9.15,63.63 11.48,61.3 U$8.P$2
N$7  (via drill 0.3)
  Top 0.203: C7.2 R1.2 19.69,90.68 18.97,89.96 IC2.1 19.69,89.28 20.07,88.9 v20.07,87.76 | v21.47,72.39 18.93,69.85 18.93,60.07 14.74,55.88 14.74,52.58 21.85,45.47 R11.1 25.66,44.45 R6.1 24.26,40.01 R7.1 24.26,35.18 v25.79,33.66 | v24.26,75.18 24.9,75.18 25.91,76.2 25.91,77.85 20.07,83.69 v20.07,85.09 | IC3.5 44.31,21.57 43.95,21.21 42.8,21.21 42.42,21.59 v42.42,24.64 | v39.25,26.16 34.67,26.16 34.04,26.8 v34.04,27.69 | v32.64,27.69 32.39,27.94 29.21,27.94 v27.82,29.34
  Bottom 0.203: v21.47,72.39 v24.26,75.18 | v20.07,85.09 v20.07,87.76 | v42.42,24.64 40.9,26.16 v39.25,26.16 | v34.04,27.69 v32.64,27.69 | v27.82,29.34 27.82,31.62 v25.79,33.66
N$8  (via drill 0.3)
  Top 0.203: R12.1 C8.1 35.82,39.88 34.58,41.12 | IC4.2 34.58,41.12 | R11.2 v26.8,45.47 | v28.07,45.47 28.45,45.47 30.61,43.31 v30.61,41.78 | v32.77,40.01 33.47,40.01 34.58,41.12
  Bottom 0.203: v26.8,45.47 v28.07,45.47 | v30.61,41.78 32.39,40.01 v32.77,40.01
N$9
  Top 0.203: IC4.9 31.98,37.11 31.37,37.72 C10.1 R9.1 26.55,37.72 R7.2
N$10
  Top 0.203: R23.2 15.72,81.76 IC2.9 15.72,84.61 14.99,85.34 R22.1
N$11
  Top 0.203: IC4.7 31.33,41.23 30.99,40.89 29.72,40.89 C9.2 29.21,42.93 R13.1
N$12
  Top 0.203: R4.1 12.96,95.5 17.53,100.08 17.53,104.3 U$13.TIP_T@3
N$13  (via drill 0.3)
  Top 0.203: R60.2 R62.2 33.15,80.01 v32.77,79.63 | U$26.TIP_T@3 42.73,56.08 37.47,61.34 37.47,70.36 38.23,71.12 38.23,71.75 37.34,72.64 35.95,72.64 35.18,71.88 34.42,71.88 v33.28,73.03 | v31.25,78.11 31.25,75.44 32.26,74.42 v33.15,74.42
  Bottom 0.203: v32.77,79.63 v31.25,78.11 | v33.15,74.42 33.15,73.15 v33.28,73.03
N$14  (via drill 0.3)
  Top 0.203: R5.2 R4.2 15.88,91.69 v16.13,91.44 | R5.2 11.18,91.44 R3.2 9.66,88.77 12.07,86.36 R2.2 | IC2.2 18.32,90.45 v18.99,91.12 19.94,92.08 20.45,92.08 R1.1 C7.1 | R5.2 11.43,91.44 11.56,91.31
  Bottom 0.203: v16.13,91.44 18.67,91.44 v18.99,91.12
N$15
  Top 0.203: R8.2 27.69,42.93 R13.2 27.44,46.23 26.93,46.74 21.34,46.74 17.73,50.35 U$3.TIP_T@3
N$16
  Top 0.203: R9.2 27.69,34.42 R14.2 | U$5.TIP_T@3 14.01,42 23.75,32.26 25.4,32.26 R14.2 | 27.31,34.04 R14.2
N$17
  Top 0.203: R15.1 R16.2 C13.1 35.82,38.35 34.58,37.11 IC4.13
N$18
  Top 0.203: R17.1 37.6,36.58 C13.2 36.83,37.34 35.69,37.34 35.23,36.88 IC4.14
N$19  (via drill 0.3)
  Top 0.203: R17.2 39.12,36.58 R16.1 40.26,36.83 41.28,37.85 41.28,42.29 35.06,48.51 v33.91,48.51 | v29.09,47.24 23.25,47.24 v22.99,47.5 | v19.94,44.45 17.28,41.78 17.51,41.78 U$17.TIP_T@3
  Bottom 0.203: v33.91,48.51 30.36,48.51 v29.09,47.24 | v22.99,47.5 v19.94,44.45
N$20
  Top 0.203: U$2.TIP_T@3 5.23,99.93 9.66,95.5 11.05,95.5 11.43,95.12 R5.1
N$22  (via drill 0.3)
  Top 0.203: R12.2 38.87,42.93 R10.2 35.18,47.12 v33.53,47.12 | v16.77,56.9 17.02,56.64 19.69,56.64 23.12,53.21 23.12,49.28 24.52,47.88 30.36,47.88 v31.12,47.12 | v15.75,57.91 14.99,58.67 6.99,58.67 5.21,56.9 5.21,54.52 U$4.TIP_T@3
  Bottom 0.203: v15.75,57.91 v16.77,56.9 | v31.12,47.12 v33.53,47.12
N$26
  Top 0.203: IC11.3 36.95,85.99 R24.1
N$27
  Top 0.203: IC3.3 45.61,23.76 R25.1
N$28
  Top 0.381: J1.10 J1.9 30.29,58.1 32.13,56.26 32.13,53.18 | 32.13,52.83 32.13,53.18 | 32.13,53.18 D1.1
N$29
  Top 0.203: IC11.5 37.45,84.69 36.58,83.82 R26.2
N$30
  Top 0.203: IC11.10 45.87,84.69 R27.2
N$31  (via drill 0.3)
  Top 0.203: R65.1 45.22,90.93 R66.2 47.5,90.68 49.91,88.27 49.91,83.82 v48.26,82.17 | U$30.TIP_T@3 42.73,69.27 v46.49,73.03 | v48.26,79.38 v48.26,77.09
  Bottom 0.203: v48.26,82.17 v48.26,79.38 | v48.26,77.09 48.26,74.8 v46.49,73.03
N$32
  Top 0.203: IC11.12 45.87,85.99 R28.2
N$33
  Top 0.203: IC4.3 33.93,43.58 R29.1
N$34
  Top 0.203: IC2.3 17.67,91.07 18.8,92.2 R30.1
N$35
  Top 0.203: IC4.5 32.63,43.2 R31.2
N$36
  Top 0.203: IC4.10 32.63,35.42 R32.2
N$37
  Top 0.203: IC4.12 33.93,35.67 R33.2
N$38
  Top 0.203: IC5.2 25.59,2.87 C15.1 R35.1 22.36,3.3 20.07,1.02 14.86,1.02 11.18,4.7 R34.2
N$39
  Top 0.203: IC5.1 26.71,3.52 25.66,4.57 25.4,4.57 C15.2 R35.2 23.12,4.83 21.98,3.68 20.58,3.68 13.21,11.05 9.4,11.05 7.62,12.83 3.05,12.83 2.42,13.46 2.42,16 2.93,16.51 2.93,21.59 2.16,22.35 2.16,24 4.32,26.16 8.89,26.16 R88.1
N$40  (via drill 0.3)
  Top 0.203: IC5.6 35.38,2.21 R37.1 C18.1 37.47,1.65 37.85,1.65 40.39,4.19 v40.9,4.19 | R36.2 58.93,91.31 57.03,89.41 57.03,85.09 59.69,82.42 59.69,72.39 57.41,70.1 57.41,67.31 59.06,65.66 59.06,59.44 57.28,57.66 57.28,54.74 58.8,53.21 58.8,24.77 57.28,23.24 57.28,19.3 57.92,18.67 57.92,16.76 48.64,7.49 48.64,4.83 46.74,2.92 45.98,2.92 v44.71,4.19
  Bottom 0.203: v44.71,4.19 v40.9,4.19
N$41  (via drill 0.3)
  Top 0.203: C18.2 R37.2 35.38,2.87 IC5.7 32.45,2.87 31.75,3.56 31.75,9.65 v30.74,10.67 | v29.09,12.32 27.56,12.32 27.05,12.83 27.05,14.61 R95.1
  Bottom 0.203: v30.74,10.67 v29.09,12.32
N$44  (via drill 0.3)
  Top 0.203: 6.5,30.12 D_1POS.+ 9.07,32.26 R40.1 14.48,32.26 16.39,30.35 16.39,29.76 D_1NEG.- 17.76,30.99 19.69,30.99 20.2,30.48 27.31,30.48 28.32,31.5 37.6,31.5 v39.63,29.46 | v42.8,29.46 43.66,28.61 IC3.6
  Bottom 0.203: v39.63,29.46 v42.8,29.46
N$45  (via drill 0.3)
  Top 0.203: D_1POS.- 5.34,28.32 7.12,28.32 7.88,29.08 7.88,30.1 9.15,31.37 12.58,31.37 15.5,28.45 17.76,28.45 D_1NEG.+ 19.02,29.69 19.31,29.97 27.56,29.97 28.58,30.99 36.83,30.99 38.99,28.83 v38.99,28.32 | IC3.7 43.01,27.1 v42.42,27.69
  Bottom 0.203: v38.99,28.32 39.63,27.69 v42.42,27.69
N$53
  Top 0.203: IC11.1 38.78,87.29 39.37,87.88 39.37,89.15 C30.2 37.6,89.41 R54.1
N$54
  Top 0.203: R51.1 40.9,29.34 48.9,37.34 48.9,44.92 U$29.P$2
N$61
  Top 0.203: R80.2 28.45,13.21 C25.2 29.98,11.94 29.64,11.6 IC1.8
N$63
  Top 0.203: U$25.TIP_T@3 42.73,5.66 39.12,9.27 R52.1
N$64
  Top 0.381: J1.2 J1.1 31.53,68.27 D2.2
N$65
  Top 0.203: R53.2 R52.2 39.12,14.99 38.36,15.75 38.36,17.53 R57.2 39.37,19.18 39.56,19.37 | C29.1 R50.1 48.26,24 48.01,23.75 46.74,23.75 46.26,23.27 IC3.2 46.26,20.22 45.34,19.3 39.88,19.3 39.56,19.37 | 39.56,19.37 39.88,19.68 39.88,23.62 R51.2
N$66  (via drill 0.3)
  Top 0.203: R56.2 37.6,90.93 R54.2 37.22,91.31 v37.22,92.2 | U$20.TIP_T@3 55.23,56.03 52.2,59.05 52.2,65.15 53.6,66.55 53.6,70.61 51.69,72.52 v51.69,74.93 | v51.69,77.34 v51.69,79.5 | v51.69,80.77 51.69,83.19 53.34,84.84 53.34,89.28 48.64,93.98 v37.22,93.98
  Bottom 0.203: v51.69,74.93 v51.69,77.34 | v51.69,79.5 v51.69,80.77 | v37.22,93.98 v37.22,92.2
N$67  (via drill 0.3)
  Top 0.203: IC3.1 46.91,22.78 47.25,23.11 48.77,23.11 49.79,24.13 R50.2 C29.2 49.79,26.92 48.9,27.81 48.14,27.81 v45.72,30.23 | R55.1 36.07,92.96 29.59,86.49 | 29.59,86.49 29.59,81.92 34.04,77.47 36.83,77.47 R58.1 R59.1 v36.07,76.2 | 29.59,86.49 28.32,85.22 26.42,85.22 24.52,87.12 17.53,87.12 16.39,88.27 16.39,89.26 IC2.5 | v42.8,33.91 42.8,34.54 43.95,35.69 45.34,35.69 45.98,36.32 45.98,39.62 37.09,48.51 37.09,60.96 36.83,61.21 36.83,71.12 v36.07,71.88
  Bottom 0.203: v36.07,71.88 v36.07,76.2 | v42.8,33.91 45.72,30.99 v45.72,30.23
N$68
  Top 0.203: IC11.2 39.15,86.64 40.39,87.88 40.39,89.15 C30.1 R56.1 40.64,92.46 R55.2
N$69
  Top 0.203: U$9.TIP_T@3 54.95,2.03 45.98,2.03 43.82,4.19 43.82,5.46 40.14,9.14 40.14,11.81 R53.1
N$70  (via drill 0.3)
  Top 0.203: R72.1 43.44,12.19 44.58,11.05 51.06,11.05 55.25,15.24 55.25,17.36 U$28.TIP_T@3 55.25,17.39 v55.25,19.94 | v39.37,30.73 40.64,30.73 44.45,34.54 v44.45,34.8 | v46.36,32.89 46.36,31.75 47.38,30.73 49.53,30.73 52.07,28.19 52.07,24.51 53.34,23.24 v53.34,21.84 | U$31.P$3 32.01,30.61 36.27,30.61 v37.51,29.38
  Bottom 0.203: v44.45,34.8 v46.36,32.89 | v53.34,21.84 v55.25,19.94 | v37.51,29.38 38.8,30.67 39.31,30.67 v39.37,30.73
N$71
  Top 0.203: IC11.6 39.66,84.04 40.64,83.06 C31.1 | R60.1 C31.1 | C31.1 40.64,79.5 38.87,77.72 R58.2
N$72
  Top 0.203: IC11.9 43.15,84.04 42.42,83.31 42.42,81.53 C32.1 R61.1 42.68,79.63 42.04,79.63 R59.2
N$73
  Top 0.203: IC11.7 39.42,83.39 39.63,83.19 39.63,82.04 C31.2 R62.1
N$74
  Top 0.203: IC1.9 30.01,10.95 31.5,12.45 C25.1 R79.2 31.37,14.73 30.1,16 30.1,18.29 29.59,18.8 27.44,18.8 26.17,20.07 23.63,20.07 23.25,19.68 U$32.12
N$76
  Top 0.203: R61.2 45.83,79.76 R63.2 55.25,80.13 58.42,76.96 58.42,72.64 55.23,69.45 U$27.TIP_T@3
N$77
  Top 0.203: IC11.13 43.15,86.64 42.42,87.38 42.42,89.15 C33.1 R65.2 42.17,92.46 R64.1
N$78
  Top 0.203: R66.1 45.22,89.41 C33.2 42.93,88.65 42.93,87.88 43.52,87.29 IC11.14
N$80
  Top 0.203: D_2POS.+ 56.12,76.56 55.12,75.56 42.46,75.56 D_2NEG.- 41.33,76.53 40.84,76.15 39.5,74.8 35.69,74.8 R68.1 34.29,76.07 24.13,86.23 15.75,86.23 14.36,87.63 14.36,90.17 14.61,90.42 15.5,90.42 15.72,90.2 IC2.6
N$81
  Top 0.203: D_2POS.- 53.94,76.58 50.3,76.58 50.04,76.33 47.76,76.33 47.52,76.56 D_2NEG.+ 42.84,77.72 41.02,77.72 40.14,76.83 40.14,76.45 39.12,75.44 35.82,75.44 35.31,75.95 35.31,76.71 34.93,77.09 33.91,77.09 24.26,86.74 16.13,86.74 15.07,87.8 IC2.7
N$84  (via drill 0.3)
  Top 0.203: IC3.10 44.31,17.92 v43.56,18.67 | v35.95,24.13 33.36,26.72 U$31.P$2 | v40.64,22.86 40.64,22.23 v42.04,20.83
  Bottom 0.203: v43.56,18.67 42.04,20.19 v42.04,20.83 | v35.95,24.13 39.63,24.13 40.64,23.11 v40.64,22.86
N$85
  Top 0.203: R57.1 R71.2 41.91,17.02 42.3,17.4 42.8,17.4 43.01,17.19 IC3.8
N$86
  Top 0.203: R72.2 43.66,14.19 IC3.9 43.66,17.56 42.68,18.54 R71.1
N$87
  Top 0.203: R82.2 26.93,6.6 C26.2 27.44,6.6 28.2,6.6 28.84,7.24 IC1.14
N$88
  Top 0.203: IC1.13 27.66,8.35 C26.1 25.66,7.87 R81.2 25.28,8.13 24.52,8.89 23.75,8.89 20.45,12.19 15.88,12.19 15.24,11.56 10.04,11.56 8.13,13.46 8.13,15.24 3.43,19.94 3.43,21.84 2.8,22.48 2.8,23.88 4.45,25.53 6.86,25.53 10.04,22.35 11.69,22.35 11.82,22.23 11.82,21.72 12.58,20.95 U$32.4
N$89  (via drill 0.3)
  Top 0.203: C27.2 11.05,18.41 U$32.6 17.02,18.41 17.53,18.92 | U$32.3 17.02,22.23 17.53,21.72 17.53,18.92 | 17.53,18.92 17.53,18.67 18.16,18.03 18.16,16.64 18.29,16.51 22.99,16.51 23.37,16.13 23.37,15.37 24.01,14.73 24.9,14.73 25.15,14.99 25.15,16.26 25.4,16.51 28.32,16.51 v28.96,15.88 | v32.13,11.43 32.39,11.18 32.39,8.38 33.07,7.7 IC1.1
  Bottom 0.203: v28.96,15.88 28.96,14.61 v32.13,11.43
N$90
  Top 0.203: IC1.6 34.01,10.95 33.02,11.94 C28.1 R86.2 33.02,14.99 32.52,15.49 31.25,15.49 30.61,16.13 30.61,18.54 29.59,19.56 27.31,19.56 25.91,20.95 U$32.13
N$91  (via drill 0.3)
  Top 0.203: IC1.7 34.67,13.08 C28.2 36.83,15.49 v36.83,19.68 | U$32.11 18.55,18.41 18.04,18.92 18.04,21.84 18.42,22.23 U$32.14 22.86,22.23 23.37,21.72 25.79,21.72 27.31,20.19 33.41,20.19 v33.91,19.68
  Bottom 0.203: v33.91,19.68 v36.83,19.68
N$92
  Top 0.203: R87.1 14.23,24.83 U$32.1
N$93
  Top 0.203: R89.2 C35.1
N$94
  Top 0.203: C35.2 R88.2 10.67,25.27 12.45,23.5 U$32.2
N$95
  Top 0.203: U$32.7 11.82,17.14 10.93,16.26 10.93,15.88 | 10.93,15.88 C36.2 | R91.1 8.39,21.59 7.5,20.7 7.5,17.27 8.89,15.88 10.93,15.88
N$96
  Top 0.203: C36.1 12.45,12.95 R92.2
N$97
  Top 0.203: C39.2 R93.1 23.75,23.5 U$32.15
N$98
  Top 0.203: R94.2 C39.1
N$99
  Top 0.203: R96.2 C40.1
N$100
  Top 0.203: U$32.10 24.26,17.14 C40.2 R95.2
OUTPUT1_SUM_TO_VCA1  (via drill 0.3)
  Top 0.203: IC4.8 31.33,36.88 31.12,37.08 | 31.12,37.08 30.87,37.34 30.36,37.34 C10.2 29.21,34.54 R14.1 28.96,32.89 27.05,30.99 20.7,30.99 20.2,31.5 16.13,31.5 12.32,35.31 10.55,35.31 6.61,31.37 3.05,31.37 2.54,30.86 2.54,28.32 3.31,27.56 v5.46,27.56 | v32.01,37.97 33.15,39.12 39.88,39.12 40.14,39.37 R15.2 | v30.74,36.7 31.12,37.08 | v5.46,24.89 6.73,24.89 8.26,23.37 v8.26,22.35
  Bottom 0.203: v32.01,37.97 v30.74,36.7 | v5.46,27.56 v5.46,24.89 | v8.26,22.35 8.26,19.42 U$14.SWITCH_T@3
OUTPUT2_SUM_TO_VCA2
  Top 0.203: IC11.8 44.03,83.39 43.44,82.8 43.44,82.04 C32.2 45.83,81.28 R63.1 47.51,81.66 47.88,81.28 48.52,81.28 49.03,81.79 49.03,82.17 51.57,84.71 51.57,87.46 U$16.SWITCH_T@3 46.07,92.96 R64.2
VCA1_CV
  Top 0.203: R85.1 19.82,12.7 15.75,12.7 14.99,11.94 10.29,11.94 8.77,13.46 8.77,15.37 5.21,18.92 5.21,23.23 U$14.TIP_B@1
VCA1_FB  (via drill 0.3)
  Top 0.203: C27.1 11.31,19.68 U$32.5 16.51,19.68 v16.64,19.56 | v19.56,14.86 20.45,14.86 21.85,13.46 R85.2 21.85,11.68 v23.37,10.16 | v17.53,14.86 17.53,17.4 v17.28,17.65 | v22.1,8.89 22.99,8 22.99,6.1 23.37,5.71 26.17,5.71 26.8,5.08 28.2,5.08 v29.98,6.86 | v32.39,6.86 35.18,6.86 35.69,7.37 35.69,8 35.34,8.35 IC1.2
  Bottom 0.203: v19.56,14.86 v17.53,14.86 | v17.28,17.65 17.28,18.92 v16.64,19.56 | v23.37,10.16 v22.1,8.89 | v29.98,6.86 v32.39,6.86
VCA1_IN
  Top 0.203: R34.1 6.58,9.4 U$12.TIP_B@1
VCA1_OUT
  Top 0.203: R82.1 R81.1 21.21,10.79 17.77,10.79 U$18.TIP_B@1
VCA1_SUMIN
  Top 0.203: IC1.12 26.56,9 R84.1
VCA2_CV  (via drill 0.3)
  Top 0.203: U$16.TIP_B@1 55.23,80.92 59.06,77.09 59.06,72.52 56.77,70.23 56.77,66.67 58.04,65.41 58.04,59.05 56.77,57.78 56.77,54.23 58.04,52.96 58.04,48.64 v55.38,45.97 | v53.85,44.45 53.85,41.4 41.79,29.34 41.79,25.53 41.66,25.4 38.48,25.4 36.2,23.11 36.2,16.38 R86.1
  Bottom 0.203: v55.38,45.97 v53.85,44.45
VCA2_IN
  Top 0.203: U$15.TIP_B@1 55.23,94 56.14,93.09 R36.1
VCA2_OUT  (via drill 0.3)
  Top 0.203: R80.1 28.45,14.73 R79.1 29.72,14.73 29.72,17.78 v29.47,18.03 | U$19.TIP_B@1 34.55,95.5 24.13,105.92 3.56,105.92 2.04,104.39 2.04,103.5 3.56,101.98 3.56,98.55 1.15,96.14 1.15,87.76 2.93,85.98 2.93,82.8 1.53,81.41 1.53,58.55 v2.54,57.53 | v3.81,56.26 3.56,56.26 2.8,55.5 2.8,53.72 5.34,51.18 5.34,49.78 11.94,43.18 v11.94,42.67 | v31.88,20.83 31.88,21.84 28.07,25.65 v28.07,26.42 | v28.07,28.07 27.56,28.07 26.04,29.59 21.72,29.59 v21.47,29.34 | v21.47,31.62 20.83,32.26 16.01,32.26 11.94,36.32 v11.94,39.5
  Bottom 0.203: v2.54,57.53 v3.81,56.26 | v29.47,18.03 29.47,18.41 v31.88,20.83 | v28.07,26.42 v28.07,28.07 | v21.47,29.34 v21.47,31.62 | v11.94,39.5 v11.94,42.67
VCA2_SUMIN
  Top 0.203: IC1.10 27.93,10.3 27.69,10.54 27.69,11.3 R83.1